# EAGLE design Estimulema v2 (EAGLE 8.7.1)

## Sheet 1 of 5
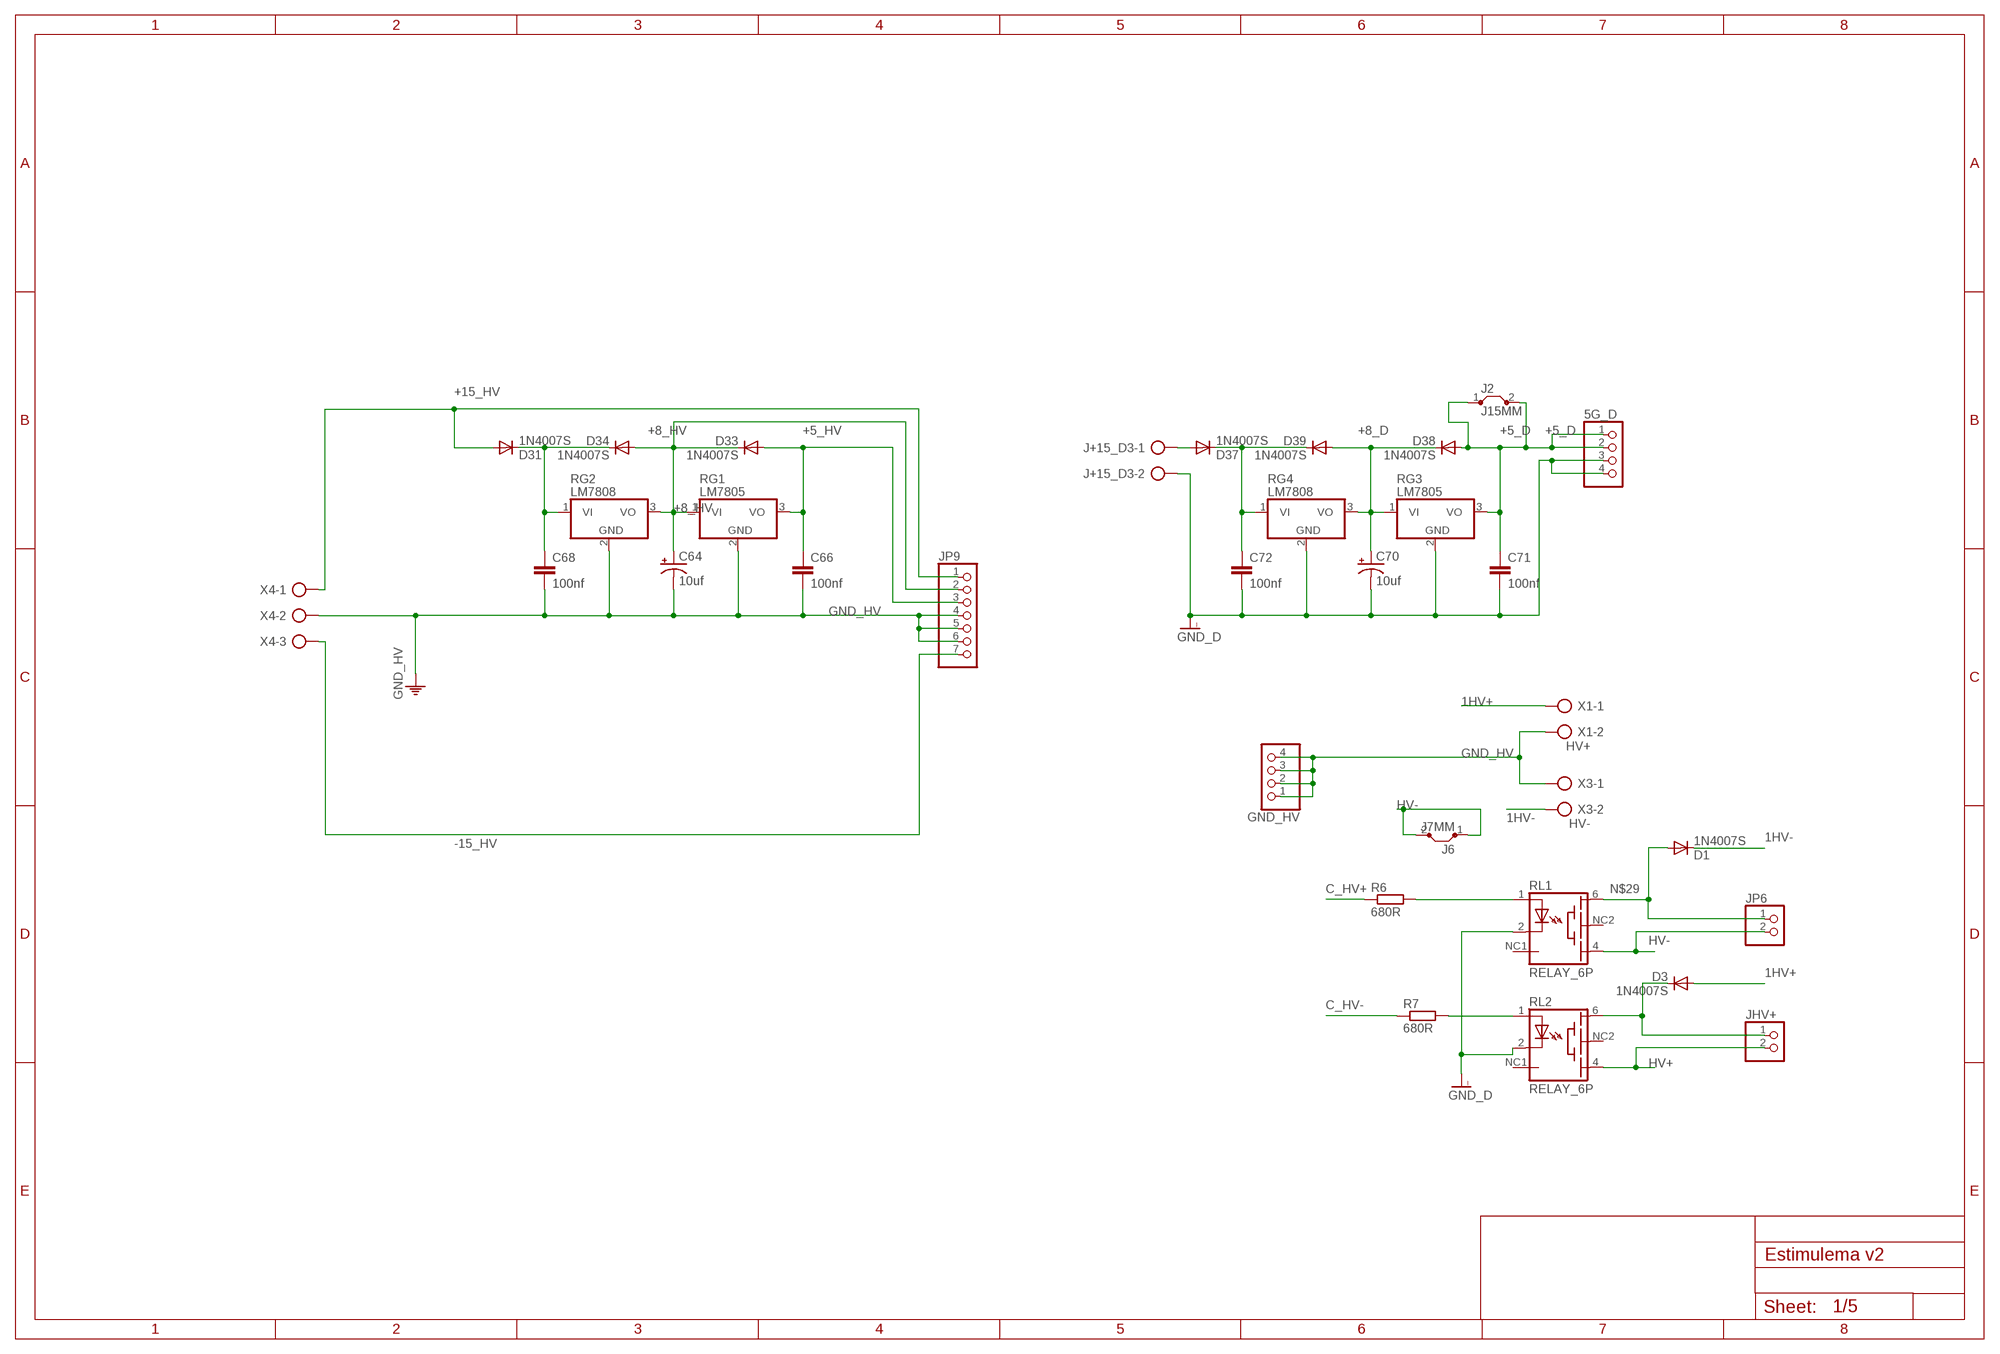
[diagram p0: schematic, sheet 1]

### Parts
5G_D  PINHD-1X4  [1X04]
C64  10uf  CPOL-USE2-5  [E2-5]
C66  100nf  C-EU025-024X044  [C025-024X044]
C68  100nf  C-EU025-024X044  [C025-024X044]
C70  10uf  CPOL-USE2-5  [E2-5]
C71  100nf  C-EU025-024X044  [C025-024X044]
C72  100nf  C-EU025-024X044  [C025-024X044]
D1  1N4007S  DIODO  [DIODO4MM]
D3  1N4007S  DIODO  [DIODO4MM]
D31  1N4007S  DIODO  [DIODO4MM]
D33  1N4007S  DIODO  [DIODO4MM]
D34  1N4007S  DIODO  [DIODO4MM]
D37  1N4007S  DIODO  [DIODO4MM]
D38  1N4007S  DIODO  [DIODO4MM]
D39  1N4007S  DIODO  [DIODO4MM]
GND_HV  PINHD-1X4  [1X04]
J2  J15MM  JUMPERS15MM  [15]
J6  J7MM  JUMPERS7MM  [07]
J+15_D3  AK300/2  [AK300/2]
JHV+  PINHD-1X2  [1X02]
JP6  PINHD-1X2  [1X02]
JP9  PINHD-1X7  [1X07]
R6  680R  RESISTORSMD_0805  [RESISTENCIA_0805]
R7  680R  RESISTORSMD_0805  [RESISTENCIA_0805]
RG1  LM7805  7805TV  [TO220V]
RG2  LM7808  7818TV  [TO220V]
RG3  LM7805  7805TV  [TO220V]
RG4  LM7808  7818TV  [TO220V]
RL1  RELAY_6P  [TS210]
RL2  RELAY_6P  [TS210]
X1  HV+  AK300/2  [AK300/2]
X3  HV-  AK300/2  [AK300/2]
X4  AK300/3  [AK300/3]

### Nets
1HV+ [GND_D]: D3.A X1.1
1HV- [GND_D]: D1.C X3.2
+5_D [+5_D]: 5G_D.1 5G_D.2 C71.1 D38.A J2.1 J2.2 RG3.3(VO) ; also sheet 2,5
+5_HV [+5_D]: C66.1 D33.A JP9.3 RG1.3(VO) ; also sheet 2
+8_D [SIGNAL]: C70.+ D38.C D39.A RG3.1(VI) RG4.3(VO)
+8_HV [SIGNAL]: C64.+ D33.C D34.A JP9.2 RG1.1(VI) RG2.3(VO)
+15_HV [SIGNAL]: D31.A JP9.1 X4.1 ; also sheet 3,4
-15_HV [SIGNAL]: JP9.7 X4.3 ; also sheet 3,4
C_HV+ [SIGNAL]: R6.1 ; also sheet 2
C_HV- [SIGNAL]: R7.1 ; also sheet 2
GND_D [GND_D]: 5G_D.3 5G_D.4 C70.- C71.2 C72.2 J+15_D3.2 RG3.2(GND) RG4.2(GND) RL1.2(C) RL2.2(C) ; also sheet 2,5
GND_HV [GND_HV1]: C64.- C66.2 C68.2 GND_HV.1 GND_HV.2 GND_HV.3 GND_HV.4 JP9.4 JP9.5 JP9.6 RG1.2(GND) RG2.2(GND) X1.2 X3.1 X4.2 ; also sheet 2,3,4,5
HV+ [GND_D]: JHV+.2 RL2.4(EMI) ; also sheet 3,4
HV- [GND_D]: J6.1 J6.2 JP6.2 RL1.4(EMI) ; also sheet 3,4
N$9: D37.A J+15_D3.1
N$24 [SIGNAL]: R6.2 RL1.1(A)
N$27 [SIGNAL]: R7.2 RL2.1(A)
N$29 [GND_D]: D1.A JP6.1 RL1.6(BAS)
N$30: D3.C JHV+.1 RL2.6(BAS)
N$157 [SIGNAL]: C68.1 D31.C D34.C RG2.1(VI)
N$158 [SIGNAL]: C72.1 D37.C D39.C RG4.1(VI)
Unconnected: RL1.NC1 RL1.NC2 RL2.NC1 RL2.NC2

## Sheet 2 of 5
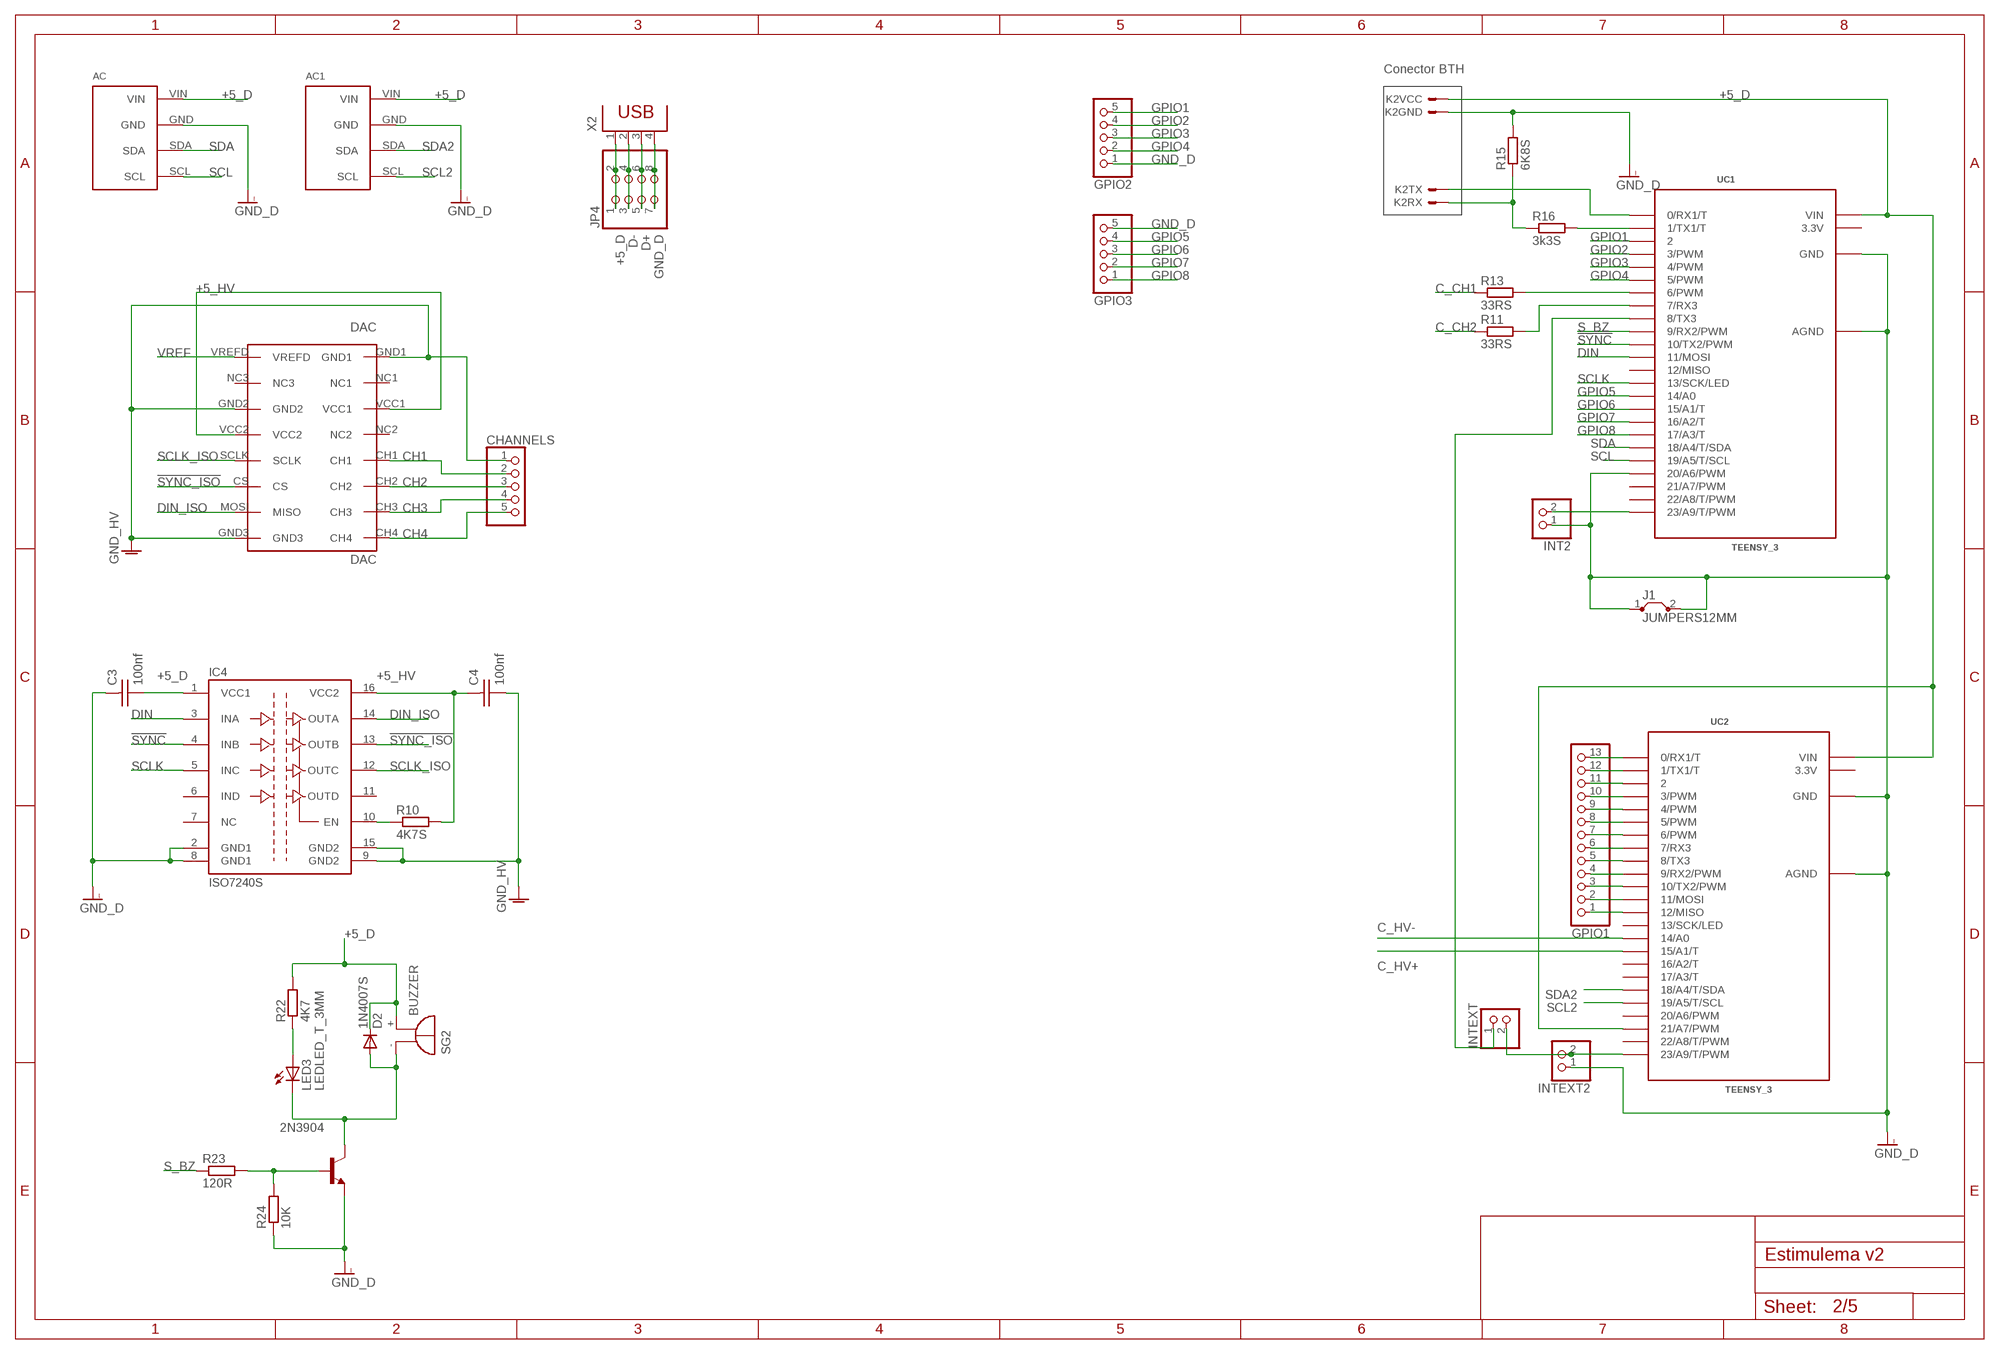
[diagram p1: schematic, sheet 2]

### Parts
2N3904  29-NPN-TO92-EBC  [TO92-EBC]
AC  CONECTOR_ACELEROMETRO_MPU6050CONECTOR_MPU6050  [MPU6050]
AC1  MPU6050  CONECTOR_ACELEROMETRO_MPU6050CONECTOR_MPU6050  [MPU6050]
C3  100nf  CAP_CERAMICO_SMD  [CAP_CER_SMD-0805]
C4  100nf  CAP_CERAMICO_SMD  [CAP_CER_SMD-0805]
CHANNELS  PINHD-1X5  [1X05]
D2  1N4007S  DIODO  [DIODO4MM]
DAC  DAC  DAC_MODULE  [DACMOD_P]
GPIO1  PINHD-1X13  [1X13]
GPIO2  PINHD-1X5  [1X05]
GPIO3  PINHD-1X5  [1X05]
IC4  ISO7240S  ISO7240_SMDDW  [SO-16DW]
INT2  PINHD-1X2  [1X02]
INTEXT  PINHD-1X2  [1X02]
INTEXT2  PINHD-1X2  [1X02]
J1  JUMPERS12MM  [12]
JP4  PINHD-2X4  [2X04]
K2  HC-06  CONECTOR_BTHC-06HC-06  [CONECTOR_BTHC-06]
LED3  LEDLED_T_3MM  [LED3MM]
R10  4K7S  RESISTORSMD_0805  [RESISTENCIA_0805]
R11  33RS  RESISTORSMD_0805  [RESISTENCIA_0805]
R13  33RS  RESISTORSMD_0805  [RESISTENCIA_0805]
R15  6K8S  RESISTORSMD_0805  [RESISTENCIA_0805]
R16  3k3S  RESISTORSMD_0805  [RESISTENCIA_0805]
R22  4K7  RESISTORSMD_0805  [RESISTENCIA_0805]
R23  120R  RESISTORSMD_0805  [RESISTENCIA_0805]
R24  10K  RESISTORSMD_0805  [RESISTENCIA_0805]
SG2  BUZZER  [BUZZER]
UC1  TEENSY_3  TEENSY_3.0_A_3.2VERSION_MINIMA  [TEENSY_3.0-3.2_DIL]
UC2  TEENSY_3  TEENSY_3.0_A_3.2VERSION_MINIMA  [TEENSY_3.0-3.2_DIL]
X2  PN61729  [PN61729]

### Nets
!SYNC [SIGNAL]: IC4.4(INB) UC1.10(10/TX2/PWM)
!SYNC_ISO [SIGNAL]: DAC.CS IC4.13(OUTB)
+5_D [+5_D]: AC1.VIN AC.VIN C3.2 D2.C IC4.1(VCC1) JP4.1 JP4.2 K2.1 R22.2 SG2.+(-) UC1.VIN UC2.21/A7(21/A7/PWM) UC2.VIN X2.1 ; also sheet 1,5
+5_HV [+5_D]: C4.1 DAC.VCC1 DAC.VCC2 IC4.16(VCC2) R10.2 ; also sheet 1
C_15D [SIGNAL]: GPIO1.11 UC2.2
C_CH1 [SIGNAL]: R13.1 ; also sheet 5
C_CH2 [SIGNAL]: R11.1 ; also sheet 5
C_HV+ [SIGNAL]: UC2.15/A1(15/A1/T) ; also sheet 1
C_HV- [SIGNAL]: UC2.14/A0 ; also sheet 1
CH1 [SIGNAL]: CHANNELS.2 DAC.CH1 ; also sheet 3
CH2 [SIGNAL]: CHANNELS.3 DAC.CH2 ; also sheet 4
CH3 [SIGNAL]: CHANNELS.4 DAC.CH3
CH4 [SIGNAL]: CHANNELS.5 DAC.CH4
D+ [SIGNAL]: JP4.5 JP4.6 X2.3
D- [SIGNAL]: JP4.3 JP4.4 X2.2
DIN [SIGNAL]: IC4.3(INA) UC1.11(11/MOSI)
DIN_ISO [SIGNAL]: DAC.MOSI(MISO) IC4.14(OUTA)
GND_D [GND_D]: 2N3904.E AC1.GND AC.GND GPIO2.1 GPIO3.5 INT2.1 INTEXT2.1 J1.1 J1.2 JP4.7 JP4.8 K2.2 R15.2 R24.1 UC1.20/A6(20/A6/PWM) UC1.AGND UC1.GND UC2.AGND UC2.GND X2.4 ; also sheet 1,5
GND_HV [GND_HV1]: C4.2 CHANNELS.1 DAC.GND1 DAC.GND2 DAC.GND3 IC4.9(GND2) IC4.15(GND2) ; also sheet 1,3,4,5
GNDI [GND_D]: C3.1 IC4.2(GND1) IC4.8(GND1) ; supply symbol labelled GND_D
GPIO1 [SIGNAL]: GPIO2.5 UC1.2
GPIO2 [SIGNAL]: GPIO2.4 UC1.3(3/PWM)
GPIO3 [SIGNAL]: GPIO2.3 UC1.4(4/PWM)
GPIO4 [SIGNAL]: GPIO2.2 UC1.5(5/PWM)
GPIO5 [SIGNAL]: GPIO3.4 UC1.14/A0
GPIO6 [SIGNAL]: GPIO3.3 UC1.15/A1(15/A1/T)
GPIO7 [SIGNAL]: GPIO3.2 UC1.16/A2(16/A2/T)
GPIO8 [SIGNAL]: GPIO3.1 UC1.17/A3(17/A3/T)
N$1: INTEXT2.2 INTEXT.2 UC2.23/A9(23/A9/T/PWM)
N$5: INTEXT.1 UC1.8(8/TX3)
N$6: GPIO1.13 UC2.0(0/RX1/T)
N$7: GPIO1.12 UC2.1(1/TX1/T)
N$10: GPIO1.10 UC2.3(3/PWM)
N$11: GPIO1.9 UC2.4(4/PWM)
N$12: GPIO1.8 UC2.5(5/PWM)
N$14: GPIO1.7 UC2.6(6/PWM)
N$15: GPIO1.6 UC2.7(7/RX3)
N$19: GPIO1.5 UC2.8(8/TX3)
N$20: GPIO1.4 UC2.9(9/RX2/PWM)
N$21: GPIO1.3 UC2.10(10/TX2/PWM)
N$22: GPIO1.2 UC2.11(11/MOSI)
N$23: GPIO1.1 UC2.12(12/MISO)
N$66 [SIGNAL]: IC4.10(EN) R10.1
N$67 [SIGNAL]: R13.2 UC1.6(6/PWM)
N$68 [SIGNAL]: R11.2 UC1.7(7/RX3)
N$69 [SIGNAL]: K2.4 R15.1 R16.1
N$70 [SIGNAL]: R16.2 UC1.1(1/TX1/T)
N$71 [SIGNAL]: K2.3 UC1.0(0/RX1/T)
N$72 [SIGNAL]: LED3.A R22.1
N$73 [SIGNAL]: 2N3904.C D2.A LED3.K(C) SG2.-(+)
N$74 [SIGNAL]: 2N3904.B R23.2 R24.2
N$75 [SIGNAL]: INT2.2 UC1.23/A9(23/A9/T/PWM)
S_BZ [SIGNAL]: R23.1 UC1.9(9/RX2/PWM)
SCL [SIGNAL]: AC.SCL UC1.19/A5(19/A5/T/SCL)
SCL2: AC1.SCL UC2.19/A5(19/A5/T/SCL)
SCLK [SIGNAL]: IC4.5(INC) UC1.13(13/SCK/LED)
SCLK_ISO [SIGNAL]: DAC.SCLK IC4.12(OUTC)
SDA [SIGNAL]: AC.SDA UC1.18/A4(18/A4/T/SDA)
SDA2: AC1.SDA UC2.18/A4(18/A4/T/SDA)
VREF [SIGNAL]: DAC.VREFD ; also sheet 3,4
Unconnected: DAC.NC1 DAC.NC2 DAC.NC3 IC4.6(IND) IC4.7(NC) IC4.11(OUTD) UC1.12(12/MISO) UC1.21/A7(21/A7/PWM) UC1.22/A8(22/A8/T/PWM) UC2.13(13/SCK/LED) UC2.16/A2(16/A2/T) UC2.17/A3(17/A3/T) UC2.20/A6(20/A6/PWM) UC2.22/A8(22/A8/T/PWM)

### Notes on the sheet
- Conector BTH

## Sheet 3 of 5
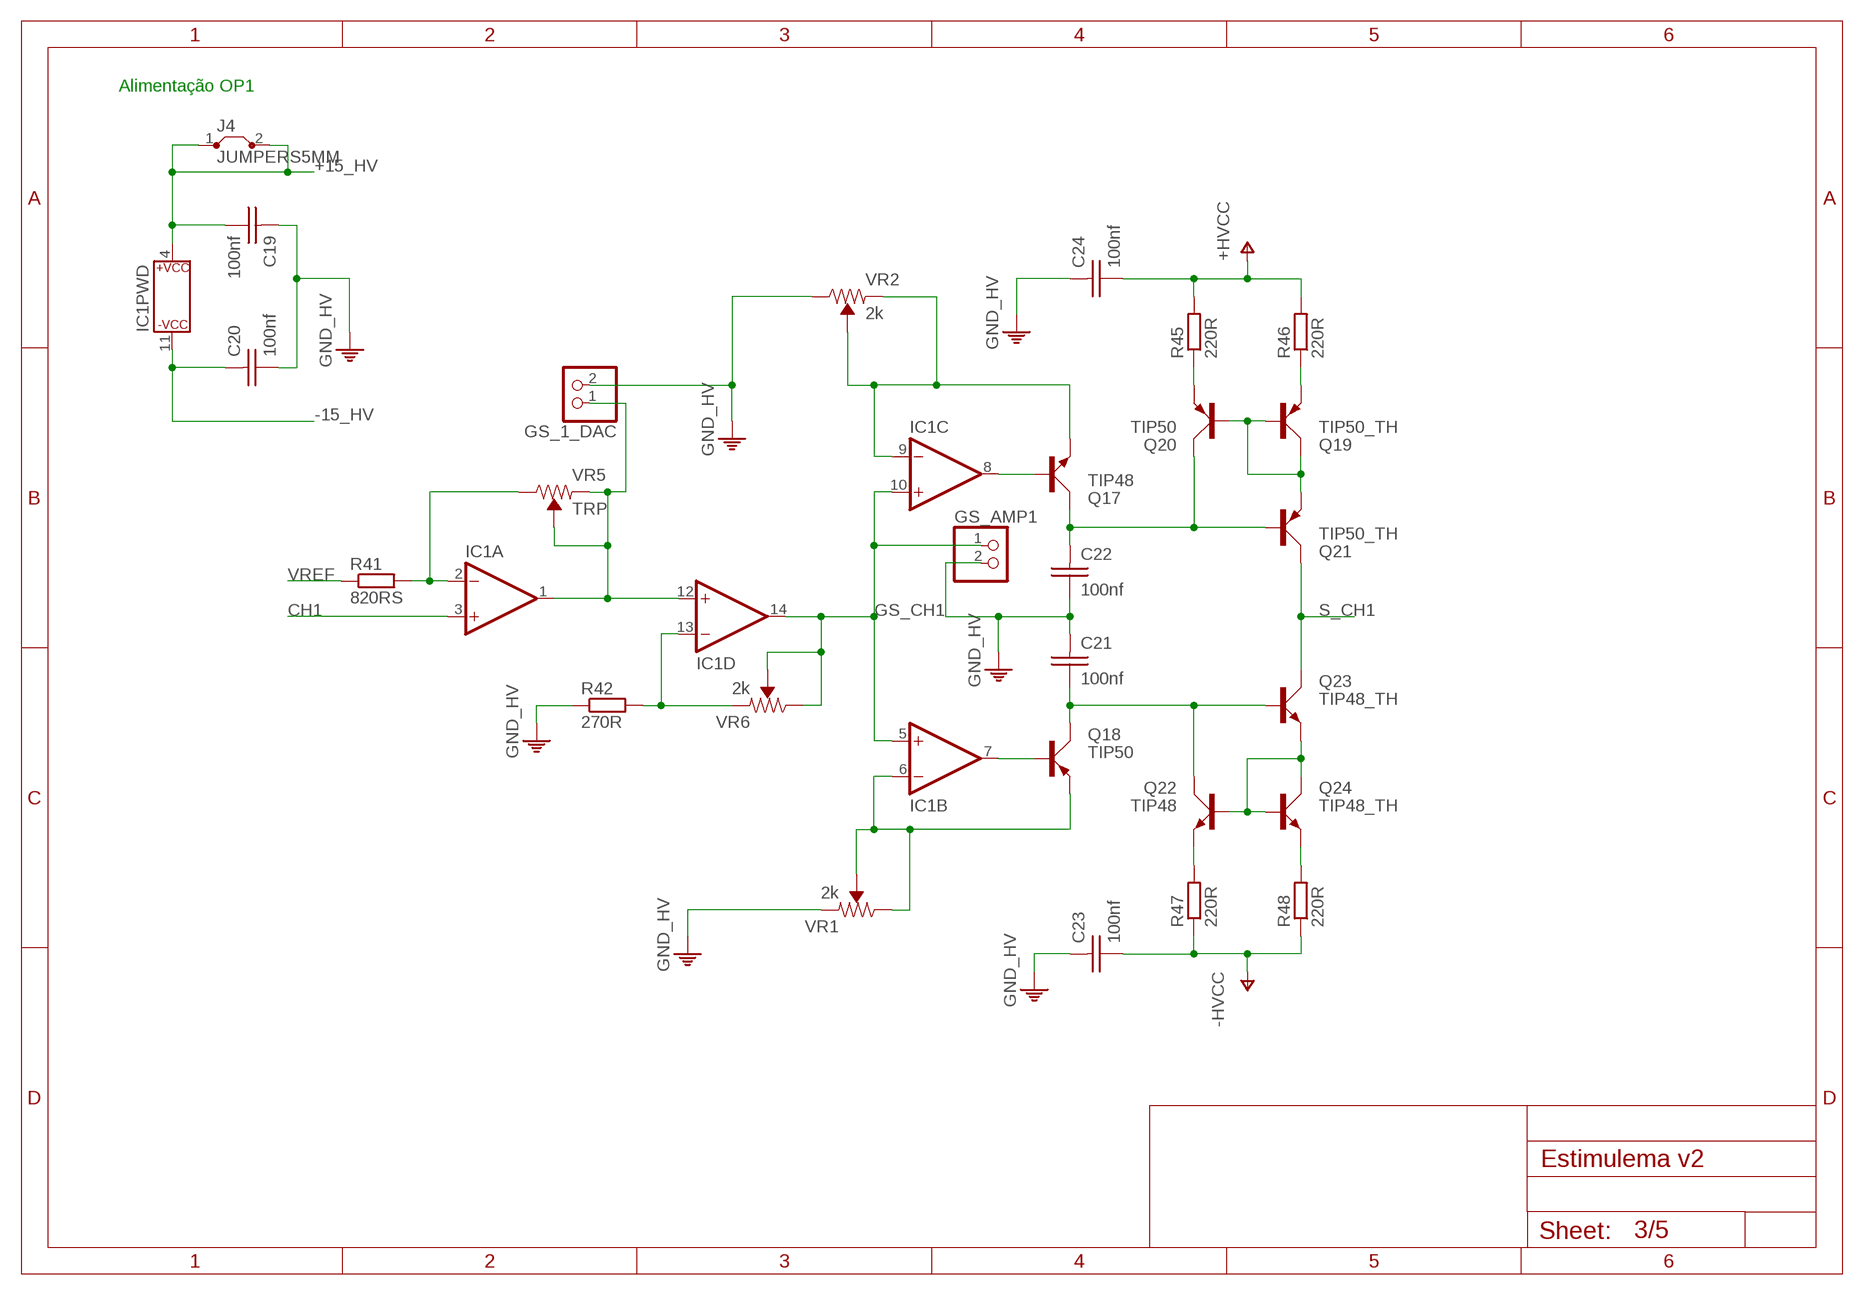
[diagram p2: schematic, sheet 3]

### Parts
C19  100nf  CAP_CERAMICO_SMD  [CAP_CER_SMD-0805]
C20  100nf  CAP_CERAMICO_SMD  [CAP_CER_SMD-0805]
C21  100nf  CAP_CERAMICO_TH2  [CAP_CER_2,54-5X5]
C22  100nf  CAP_CERAMICO_TH2  [CAP_CER_2,54-5X5]
C23  100nf  CAP_CERAMICO_TH16  [CAP_CER_16X7]
C24  100nf  CAP_CERAMICO_TH16  [CAP_CER_16X7]
GS_1_DAC  PINHD-1X2  [1X02]
GS_AMP1  PINHD-1X2  [1X02]
IC1  TL084  [DIL14]
J4  JUMPERS5MM  [05]
Q17  TIP48  TIP48_TH  [TO220]
Q18  TIP50  TIP50_TH  [TO220]
Q19  TIP50_TH  [TO220]
Q20  TIP50  TIP50_TH  [TO220]
Q21  TIP50_TH  [TO220]
Q22  TIP48  TIP48_TH  [TO220]
Q23  TIP48_TH  [TO220]
Q24  TIP48_TH  [TO220]
R41  820RS  RESISTORSMD_0805  [RESISTENCIA_0805]
R42  270R  RESISTORSMD_0805  [RESISTENCIA_0805]
R45  220R  RESISTORT_CORTO  [0204V]
R46  220R  RESISTORT_CORTO  [0204V]
R47  220R  RESISTORT_CORTO  [0204V]
R48  220R  RESISTORT_CORTO  [0204V]
VR1  2k  TRIMPOT_TH  [TRIMPOT-PTH-3386U]
VR2  2k  TRIMPOT_TH  [TRIMPOT-PTH-3386U]
VR5  TRP  TRIMPOT_TH  [TRIMPOT-PTH-3386U]
VR6  2k  TRIMPOT_TH  [TRIMPOT-PTH-3386U]

### Nets
+15_HV [SIGNAL]: C19.2 IC1.4(PWD:P$V+) J4.1 J4.2 ; also sheet 1,4
-15_HV [SIGNAL]: C20.1 IC1.11(PWD:P$V-) ; also sheet 1,4
CH1 [SIGNAL]: IC1.3(A:+IN) ; also sheet 2
GND_HV [GND_HV1]: C19.1 C20.2 C21.1 C22.2 C23.1 C24.1 GS_1_DAC.2 GS_AMP1.2 R42.1 VR1.1(CCW) VR2.3(CW) ; also sheet 1,2,4,5
GS_CH1 [SIGNAL]: GS_AMP1.1 IC1.5(B:+IN) IC1.10(C:+IN) IC1.14(D:OUT) VR6.2(WIPER) VR6.3(CW)
HV+ [GND_D]: C24.2 R45.2 R46.2 ; supply symbol labelled +HVCC ; also sheet 1,4
HV- [GND_D]: C23.2 R47.1 R48.1 ; supply symbol labelled -HVCC ; also sheet 1,4
N$106 [SIGNAL]: IC1.2(A:-IN) R41.2 VR5.3(CW)
N$107 [SIGNAL]: GS_1_DAC.1 IC1.1(A:OUT) IC1.12(D:+IN) VR5.1(CCW) VR5.2(WIPER)
N$108 [SIGNAL]: IC1.13(D:-IN) R42.2 VR6.1(CCW)
N$109 [SIGNAL]: IC1.9(C:-IN) Q17.E VR2.1(CCW) VR2.2(WIPER)
N$110 [SIGNAL]: IC1.6(B:-IN) Q18.E VR1.2(WIPER) VR1.3(CW)
N$111 [SIGNAL]: C21.2 Q18.C Q22.C Q23.B
N$112 [SIGNAL]: C22.1 Q17.C Q20.C Q21.B
N$113 [SIGNAL]: Q20.E R45.1
N$114 [GND_HV1]: Q19.E R46.1
N$115 [GND_HV1]: Q19.B Q19.C Q20.B Q21.E
N$116 [GND_HV1]: Q22.B Q23.E Q24.B Q24.C
N$117 [SIGNAL]: Q22.E R47.2
N$118 [GND_HV1]: Q24.E R48.2
N$119 [SIGNAL]: IC1.8(C:OUT) Q17.B
N$120 [SIGNAL]: IC1.7(B:OUT) Q18.B
S_CH1 [GND_HV1]: Q21.C Q23.C ; also sheet 5
VREF [SIGNAL]: R41.1 ; also sheet 2,4

### Notes on the sheet
- Alimentação OP1

## Sheet 4 of 5
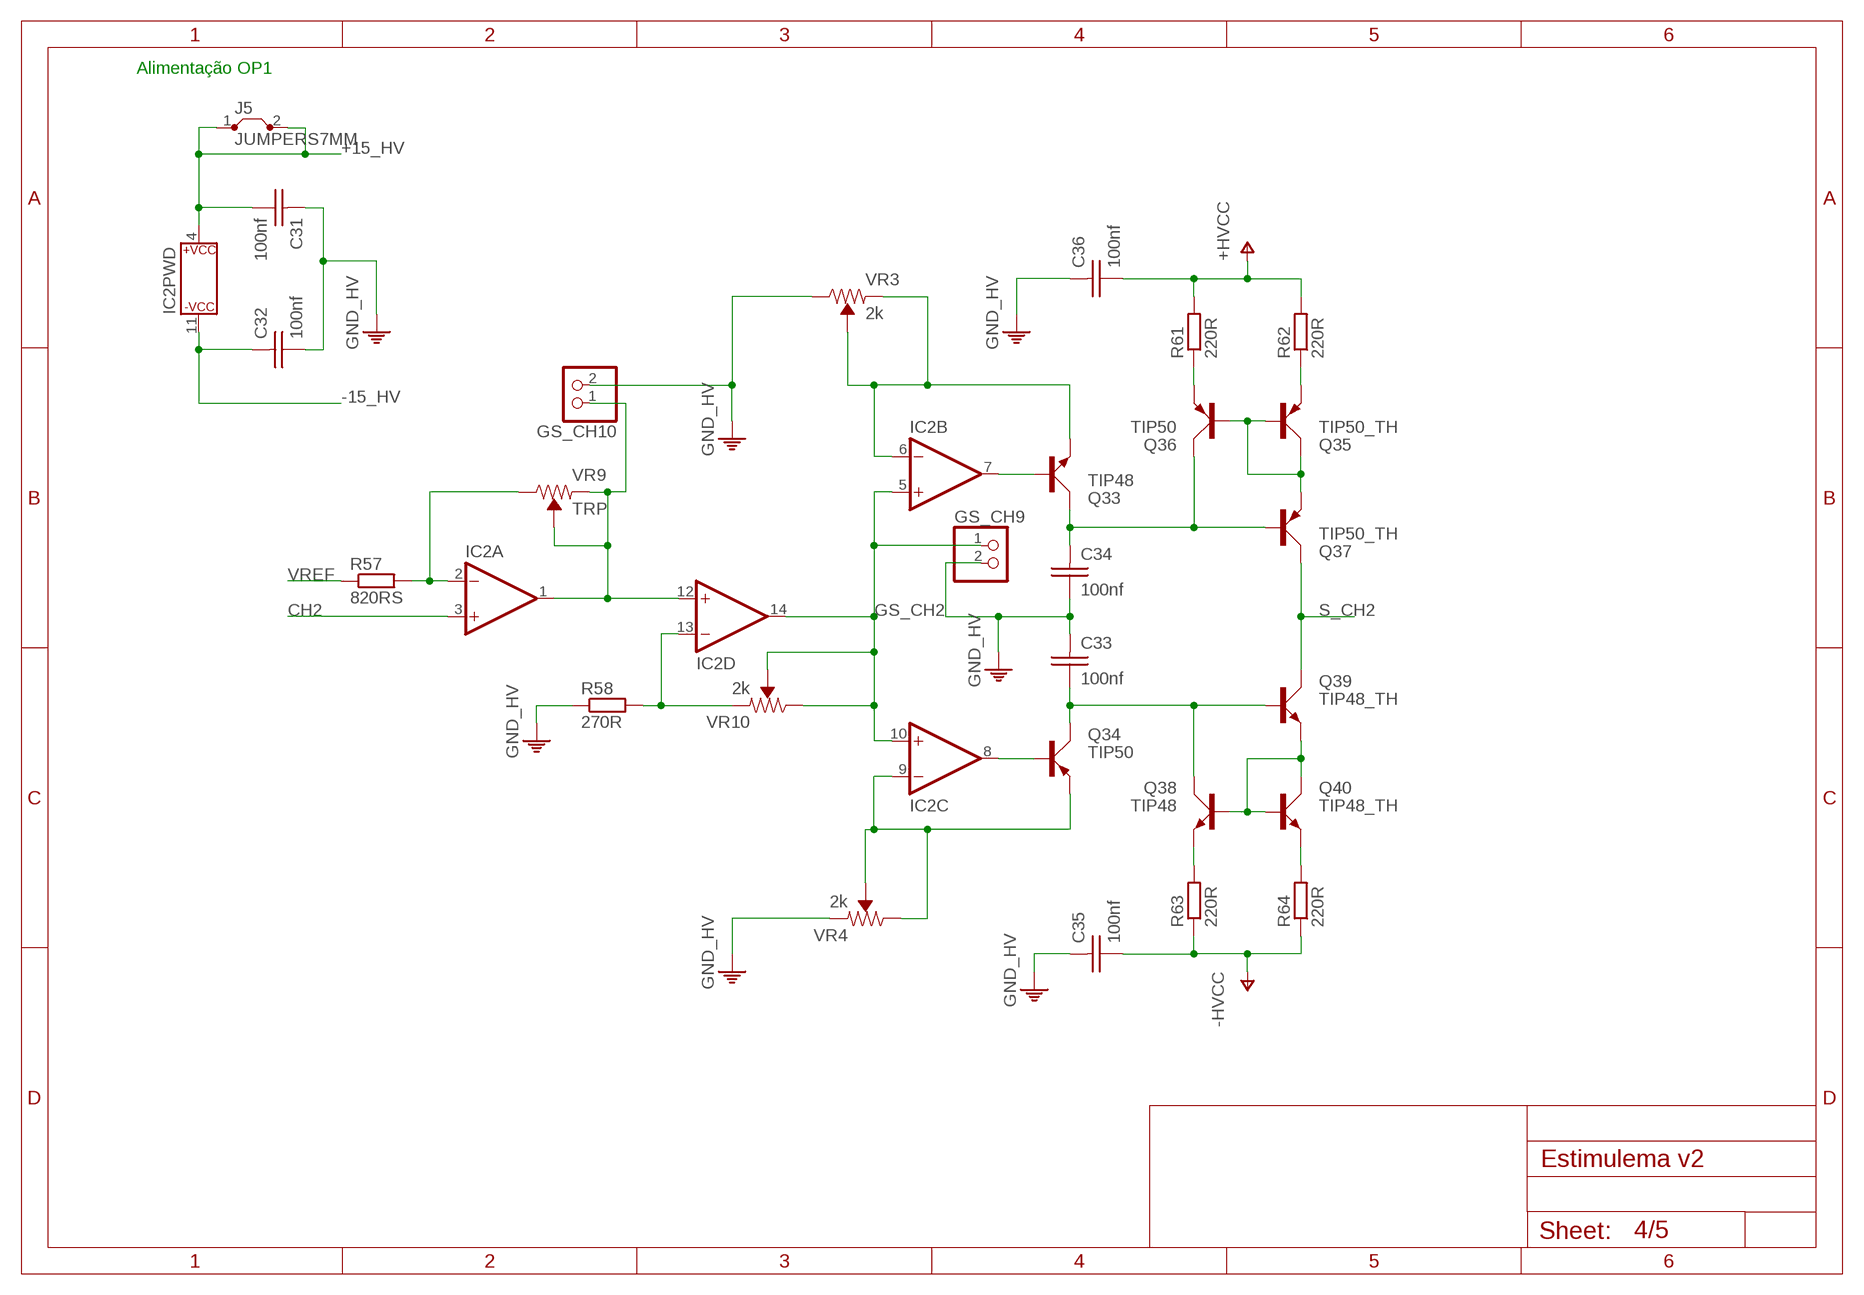
[diagram p3: schematic, sheet 4]

### Parts
C31  100nf  CAP_CERAMICO_SMD  [CAP_CER_SMD-0805]
C32  100nf  CAP_CERAMICO_SMD  [CAP_CER_SMD-0805]
C33  100nf  CAP_CERAMICO_TH2  [CAP_CER_2,54-5X5]
C34  100nf  CAP_CERAMICO_TH2  [CAP_CER_2,54-5X5]
C35  100nf  CAP_CERAMICO_TH16  [CAP_CER_16X7]
C36  100nf  CAP_CERAMICO_TH16  [CAP_CER_16X7]
GS_CH9  PINHD-1X2  [1X02]
GS_CH10  PINHD-1X2  [1X02]
IC2  TL084  [DIL14]
J5  JUMPERS7MM  [07]
Q33  TIP48  TIP48_TH  [TO220]
Q34  TIP50  TIP50_TH  [TO220]
Q35  TIP50_TH  [TO220]
Q36  TIP50  TIP50_TH  [TO220]
Q37  TIP50_TH  [TO220]
Q38  TIP48  TIP48_TH  [TO220]
Q39  TIP48_TH  [TO220]
Q40  TIP48_TH  [TO220]
R57  820RS  RESISTORSMD_0805  [RESISTENCIA_0805]
R58  270R  RESISTORSMD_0805  [RESISTENCIA_0805]
R61  220R  RESISTORT_CORTO  [0204V]
R62  220R  RESISTORT_CORTO  [0204V]
R63  220R  RESISTORT_CORTO  [0204V]
R64  220R  RESISTORT_CORTO  [0204V]
VR3  2k  TRIMPOT_TH  [TRIMPOT-PTH-3386U]
VR4  2k  TRIMPOT_TH  [TRIMPOT-PTH-3386U]
VR9  TRP  TRIMPOT_TH  [TRIMPOT-PTH-3386U]
VR10  2k  TRIMPOT_TH  [TRIMPOT-PTH-3386U]

### Nets
+15_HV [SIGNAL]: C31.2 IC2.4(PWD:P$V+) J5.1 J5.2 ; also sheet 1,3
-15_HV [SIGNAL]: C32.1 IC2.11(PWD:P$V-) ; also sheet 1,3
CH2 [SIGNAL]: IC2.3(A:+IN) ; also sheet 2
GND_HV [GND_HV1]: C31.1 C32.2 C33.1 C34.2 C35.1 C36.1 GS_CH9.2 GS_CH10.2 R58.1 VR3.3(CW) VR4.1(CCW) ; also sheet 1,2,3,5
GS_CH2 [SIGNAL]: GS_CH9.1 IC2.5(B:+IN) IC2.10(C:+IN) IC2.14(D:OUT) VR10.2(WIPER) VR10.3(CW)
HV+ [GND_D]: C36.2 R61.2 R62.2 ; supply symbol labelled +HVCC ; also sheet 1,3
HV- [GND_D]: C35.2 R63.1 R64.1 ; supply symbol labelled -HVCC ; also sheet 1,3
N$136 [SIGNAL]: IC2.2(A:-IN) R57.2 VR9.3(CW)
N$137 [SIGNAL]: GS_CH10.1 IC2.1(A:OUT) IC2.12(D:+IN) VR9.1(CCW) VR9.2(WIPER)
N$138 [SIGNAL]: IC2.13(D:-IN) R58.2 VR10.1(CCW)
N$139 [SIGNAL]: IC2.6(B:-IN) Q33.E VR3.1(CCW) VR3.2(WIPER)
N$140 [SIGNAL]: IC2.9(C:-IN) Q34.E VR4.2(WIPER) VR4.3(CW)
N$141 [SIGNAL]: C33.2 Q34.C Q38.C Q39.B
N$142 [SIGNAL]: C34.1 Q33.C Q36.C Q37.B
N$143 [SIGNAL]: Q36.E R61.1
N$144 [GND_HV1]: Q35.E R62.1
N$145 [GND_HV1]: Q35.B Q35.C Q36.B Q37.E
N$146 [GND_HV1]: Q38.B Q39.E Q40.B Q40.C
N$147 [SIGNAL]: Q38.E R63.2
N$148 [GND_HV1]: Q40.E R64.2
N$149 [SIGNAL]: IC2.7(B:OUT) Q33.B
N$150 [SIGNAL]: IC2.8(C:OUT) Q34.B
S_CH2 [SIGNAL]: Q37.C Q39.C ; also sheet 5
VREF [SIGNAL]: R57.1 ; also sheet 2,3

### Notes on the sheet
- Alimentação OP1

## Sheet 5 of 5
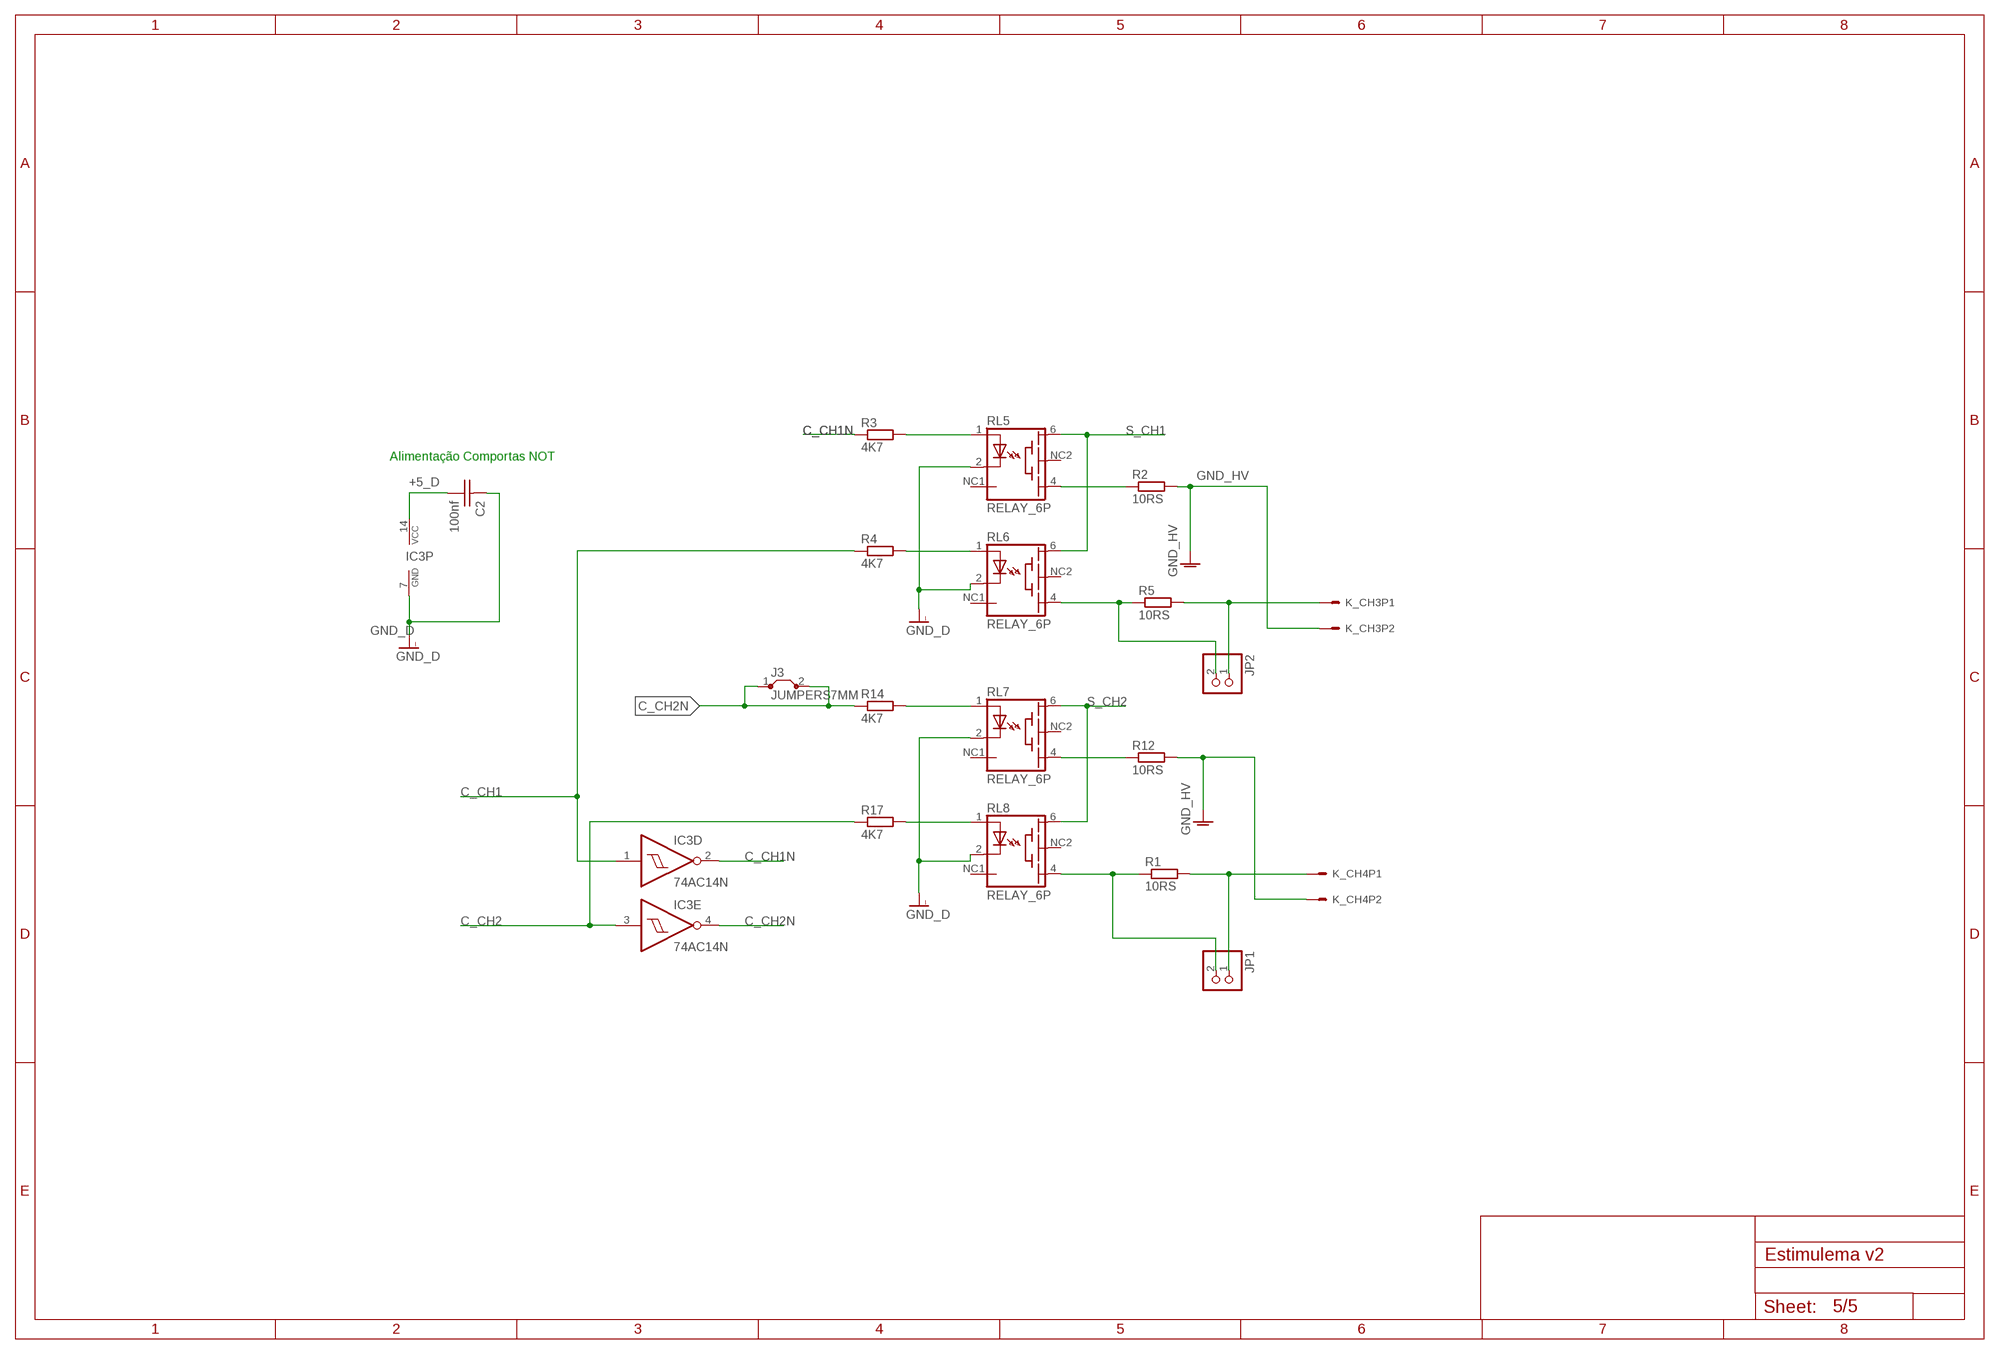
[diagram p4: schematic, sheet 5]

### Parts
C2  100nf  CAP_CERAMICO_SMD  [CAP_CER_SMD-0805]
IC3  74AC14N  [DIL14]
J3  JUMPERS7MM  [07]
JP1  PINHD-1X2  [1X02]
JP2  PINHD-1X2  [1X02]
K_CH3  CONECTOR_5.08  [CONECTOR_X2_5.08]
K_CH4  CONECTOR_5.08  [CONECTOR_X2_5.08]
R1  10RS  RESISTORT_LARGO  [0204/5]
R2  10RS  RESISTORT_GRANDE  [0617V]
R3  4K7  RESISTORSMD_0805  [RESISTENCIA_0805]
R4  4K7  RESISTORSMD_0805  [RESISTENCIA_0805]
R5  10RS  RESISTORT_LARGO  [0204/5]
R12  10RS  RESISTORT_GRANDE  [0617V]
R14  4K7  RESISTORSMD_0805  [RESISTENCIA_0805]
R17  4K7  RESISTORSMD_0805  [RESISTENCIA_0805]
RL5  RELAY_6P  [TS210]
RL6  RELAY_6P  [TS210]
RL7  RELAY_6P  [TS210]
RL8  RELAY_6P  [TS210]

### Nets
+5_D [+5_D]: C2.2 IC3.14(P:VCC) ; also sheet 1,2
C_CH1 [SIGNAL]: IC3.1(D:I) R4.1 ; also sheet 2
C_CH1N [SIGNAL]: IC3.2(D:O) R3.1
C_CH2 [SIGNAL]: IC3.3(E:I) R17.1 ; also sheet 2
C_CH2N [SIGNAL]: IC3.4(E:O) J3.1 J3.2 R14.1
GND_D [GND_D]: C2.1 IC3.7(P:GND) RL5.2(C) RL6.2(C) RL7.2(C) RL8.2(C) ; also sheet 1,2
GND_HV [GND_HV1]: K_CH3.2 K_CH4.2 R2.2 R12.2 ; also sheet 1,2,3,4
N$2 [SIGNAL]: R3.2 RL5.1(A)
N$3 [SIGNAL]: R4.2 RL6.1(A)
N$4 [GND_HV1]: R2.1 RL5.4(EMI)
N$8: JP2.2 R5.1 RL6.4(EMI)
N$13 [SIGNAL]: R14.2 RL7.1(A)
N$16 [SIGNAL]: R17.2 RL8.1(A)
N$17 [GND_HV1]: R12.1 RL7.4(EMI)
N$18: JP2.1 K_CH3.1 R5.2
N$25: JP1.1 K_CH4.1 R1.2
N$26: JP1.2 R1.1 RL8.4(EMI)
S_CH1 [GND_HV1]: RL5.6(BAS) RL6.6(BAS) ; also sheet 3
S_CH2 [SIGNAL]: RL7.6(BAS) RL8.6(BAS) ; also sheet 4
Unconnected: IC3.5(F:I) IC3.6(F:O) IC3.8(C:O) IC3.9(C:I) IC3.10(B:O) IC3.11(B:I) IC3.12(A:O) IC3.13(A:I) RL5.NC1 RL5.NC2 RL6.NC1 RL6.NC2 RL7.NC1 RL7.NC2 RL8.NC1 RL8.NC2

### Notes on the sheet
- Alimentação Comportas NOT

## Power pins joined to a net without a drawn wire
3.3V: UC1.3.3V UC2.3.3V

## Library data of the parts
2N3904 = transistor:*-NPN-: NPN Transistror BF959 corrected 2008.03.06
5G_D GND_HV = pinhead:PINHD-1X4: PIN HEADER
AC AC1 = 7DI Library:CONECTOR_ACELEROMETRO_MPU6050: Conector para el Acelerometro MPU6050 I2C
C2-C4 C19-C24 C31-C36 = 7DI Library:CAP_CERAMICO: Capacitores ceramicos y de poliester, entre otros
C64 C70 = resistor:CPOL-US: POLARIZED CAPACITOR, American symbol
C66 C68 C71 C72 = resistor:C-EU: CAPACITOR, European symbol
CHANNELS GPIO2 GPIO3 = pinhead:PINHD-1X5: PIN HEADER
D1-D3 D31 D33 D34 D37-D39 = 7DI Library:DIODO: Diodo usado para protecion en las fuentes de alimentacion
DAC = 7DI Library:DAC_MODULE: Modulo feito para o dac com seu regulador
GPIO1 = pinhead:PINHD-1X13: PIN HEADER
GS_1_DAC GS_AMP1 GS_CH9 GS_CH10 INT2 INTEXT INTEXT2 JHV+ JP1 JP2 JP6 = pinhead:PINHD-1X2: PIN HEADER
IC1 IC2 = 7DI Library:TL084: IC TL084 Quad Op Amp
IC3 = 74xx-eu:74*14: Hex schmitt trigger INVERTER
IC4 = 7DI Library:ISO7240_SMD: ISO7240 High Speed Quad Digital Isolators
J1-J6 = 7DI Library:JUMPERS: Bridge
J+15_D3 X1 X3 = con-ptr500:AK300/2: CONNECTOR; OC_FARNELL: unknown; OC_NEWARK: unknown
JP4 = pinhead:PINHD-2X4: PIN HEADER
JP9 = pinhead:PINHD-1X7: PIN HEADER
K2 = 7DI Library:CONECTOR_BTHC-06: CONECTOR DEL MODULO BLUETOOTH HC-06
K_CH3 K_CH4 = 7DI Library:CONECTOR_: Diferentes tipos de conectores
LED3 = 7DI Library:LED: Diodo led de 3, 5 mm y SMD 0805
Q17 Q22-Q24 Q33 Q38-Q40 = 7DI Library:TIP48: NPN TRANSISTOR
Q18-Q21 Q34-Q37 = 7DI Library:TIP50: PNP TRANSISTOR
R1-R7 R10-R17 R22-R24 R41 R42 R45-R48 R57 R58 R61-R64 = 7DI Library:RESISTOR: Resistor con varias variantes
RG1-RG4 = linear:78*: Positive VOLTAGE REGULATOR Source: http://cache.national.com/ds/LM/LM78L05.pdf http://www.fairchildsemi.com/ds/LM/LM7805.pdf
RL1 RL2 RL5-RL8 = 7DI Library:RELAY_: Rele de estado solido
SG2 = 7DI Library:BUZZER: BUZZER Source: Buerklin; OC_FARNELL: unknown; OC_NEWARK: unknown
UC1 UC2 = 7DI Library:TEENSY_3.0_A_3.2: Unidade de controle baseada em Teensy 3.x
VR1-VR4 VR6 VR10 = 7DI Library:TRIMPOT: Trimming Potentiometer (Trimpot); PROD_ID: ''; SF_SKU: ''; VALUE: TRP
VR5 VR9 = 7DI Library:TRIMPOT: Trimming Potentiometer (Trimpot); PROD_ID: ''; SF_SKU: ''
X2 = con-berg:PN61729: BERG USB connector; OC_FARNELL: unknown; OC_NEWARK: unknown
X4 = con-ptr500:AK300/3: CONNECTOR; OC_FARNELL: unknown; OC_NEWARK: unknown

## Net classes
1 GND_HV: width 0.813 mm
2 SIGNAL: width 0.508 mm
3 GND_D: width 0.61 mm
4 +5_D: width 0.61 mm
5 GND_HV1: width 0.813 mm

## Board
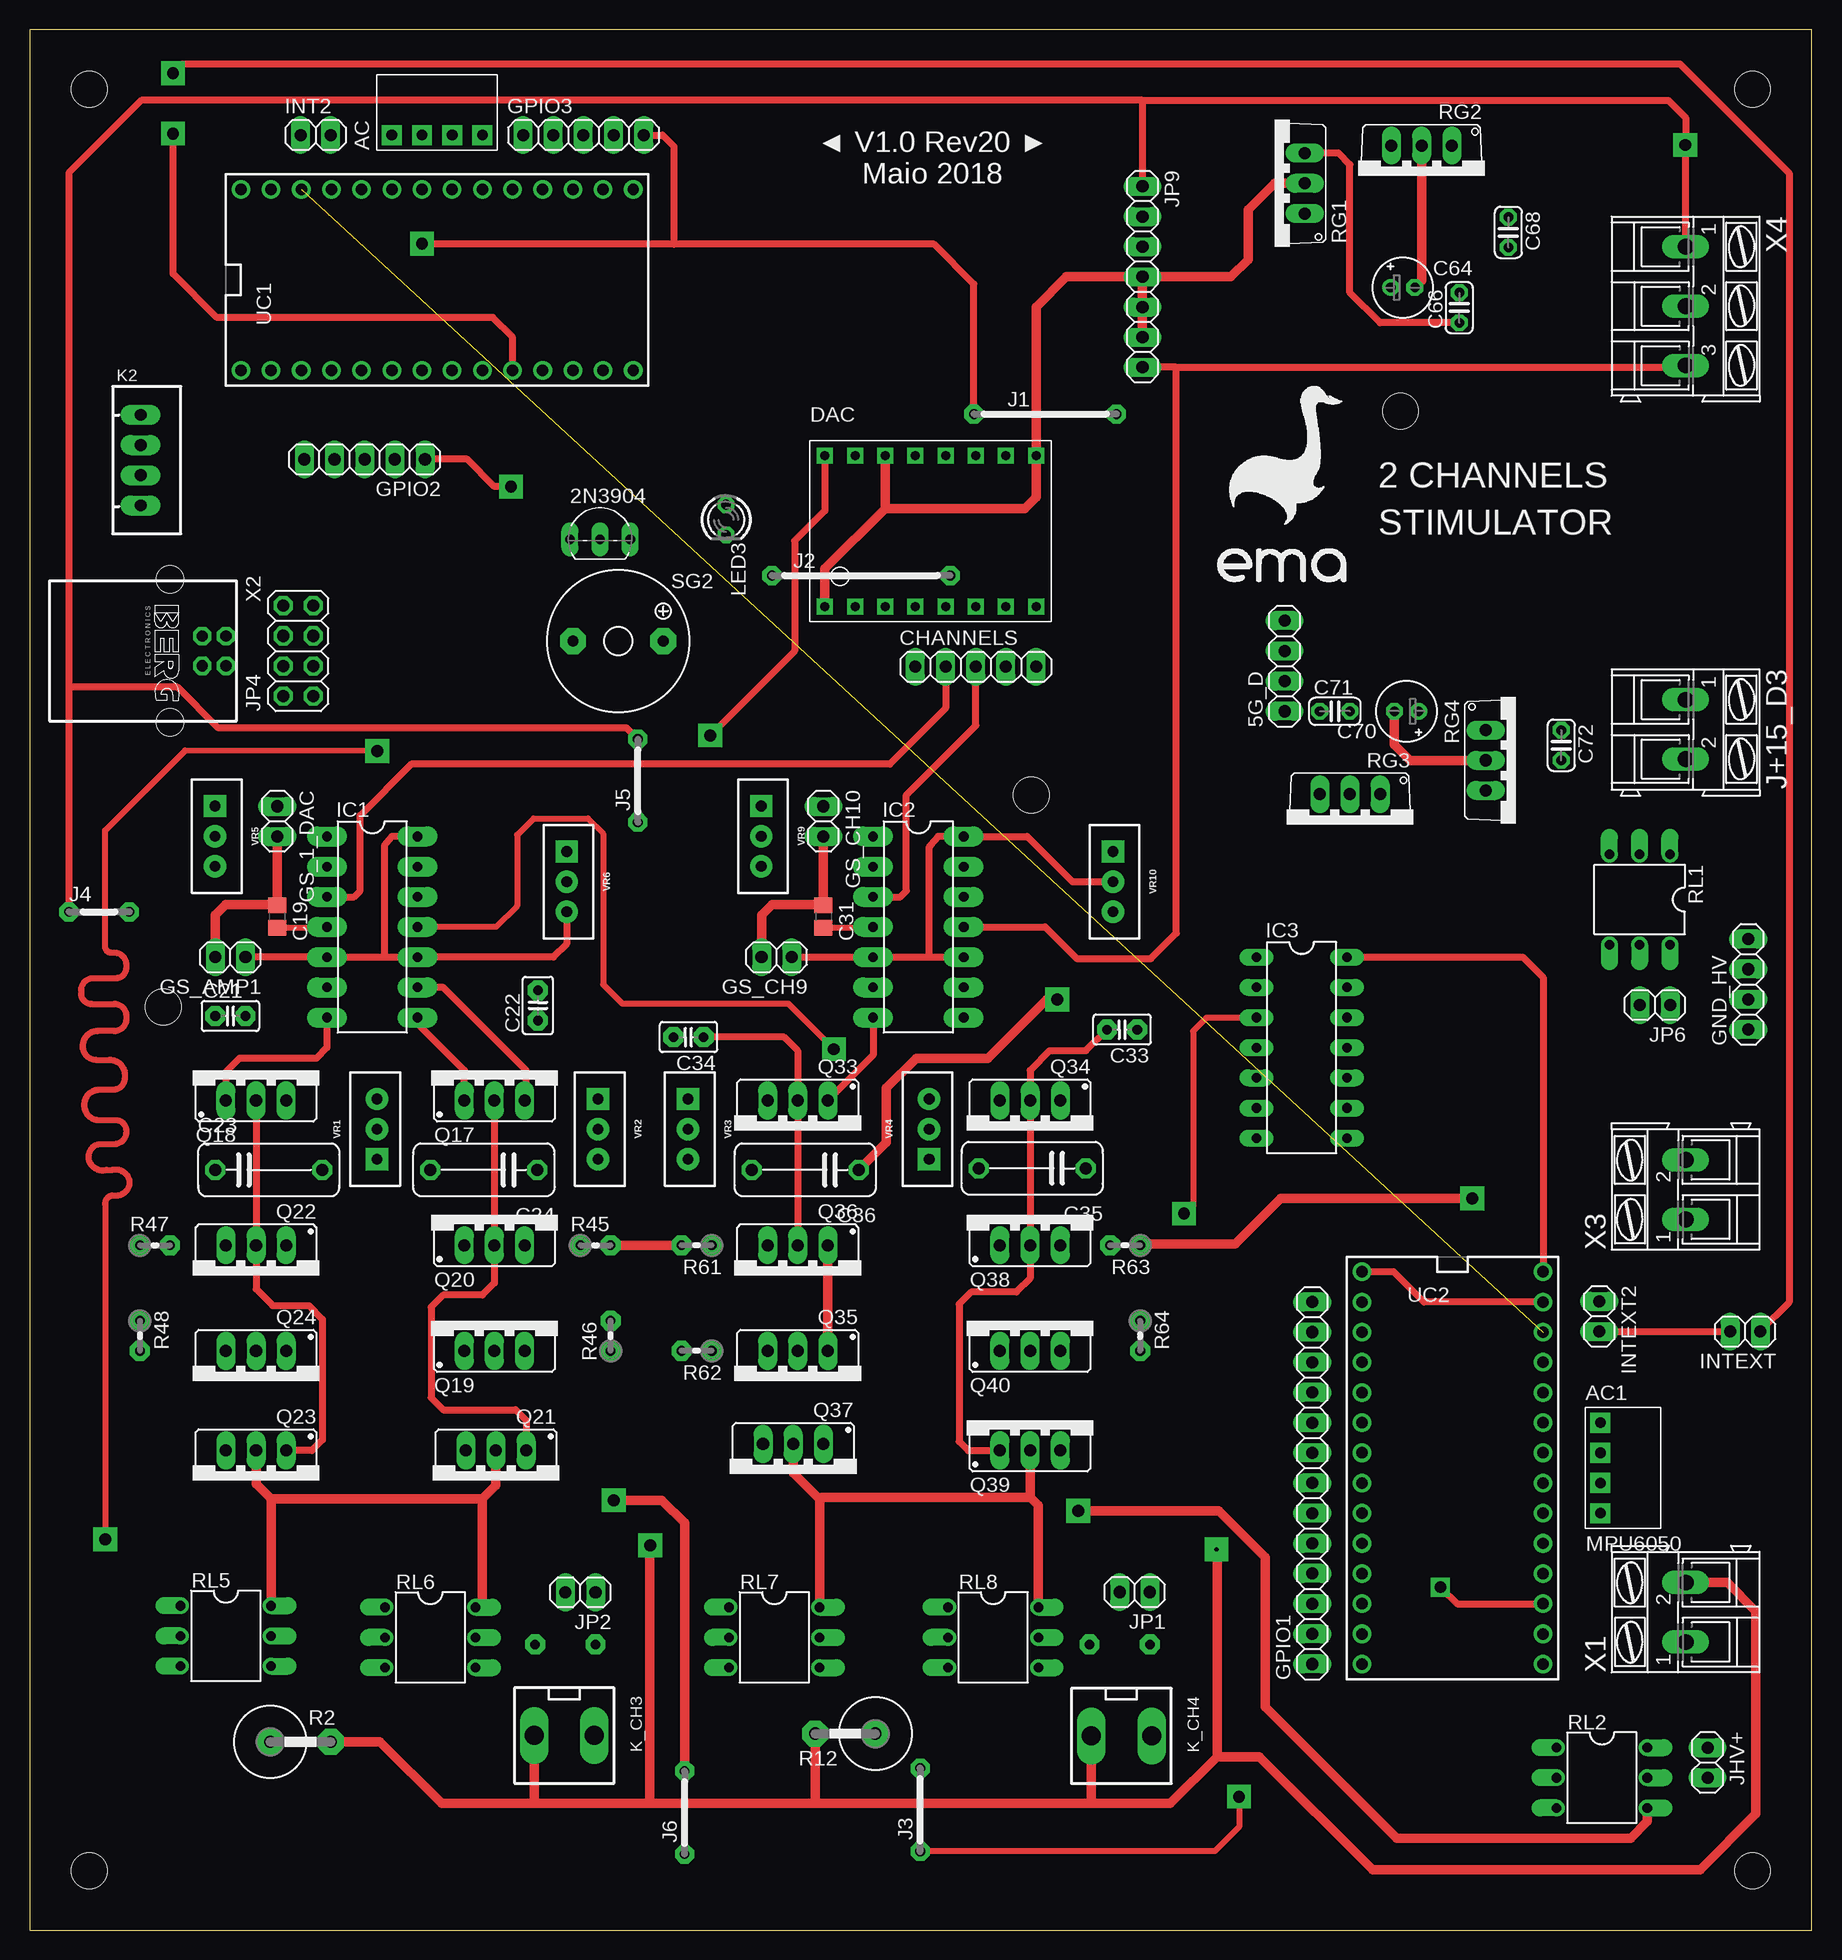
[diagram p5: board, top side]
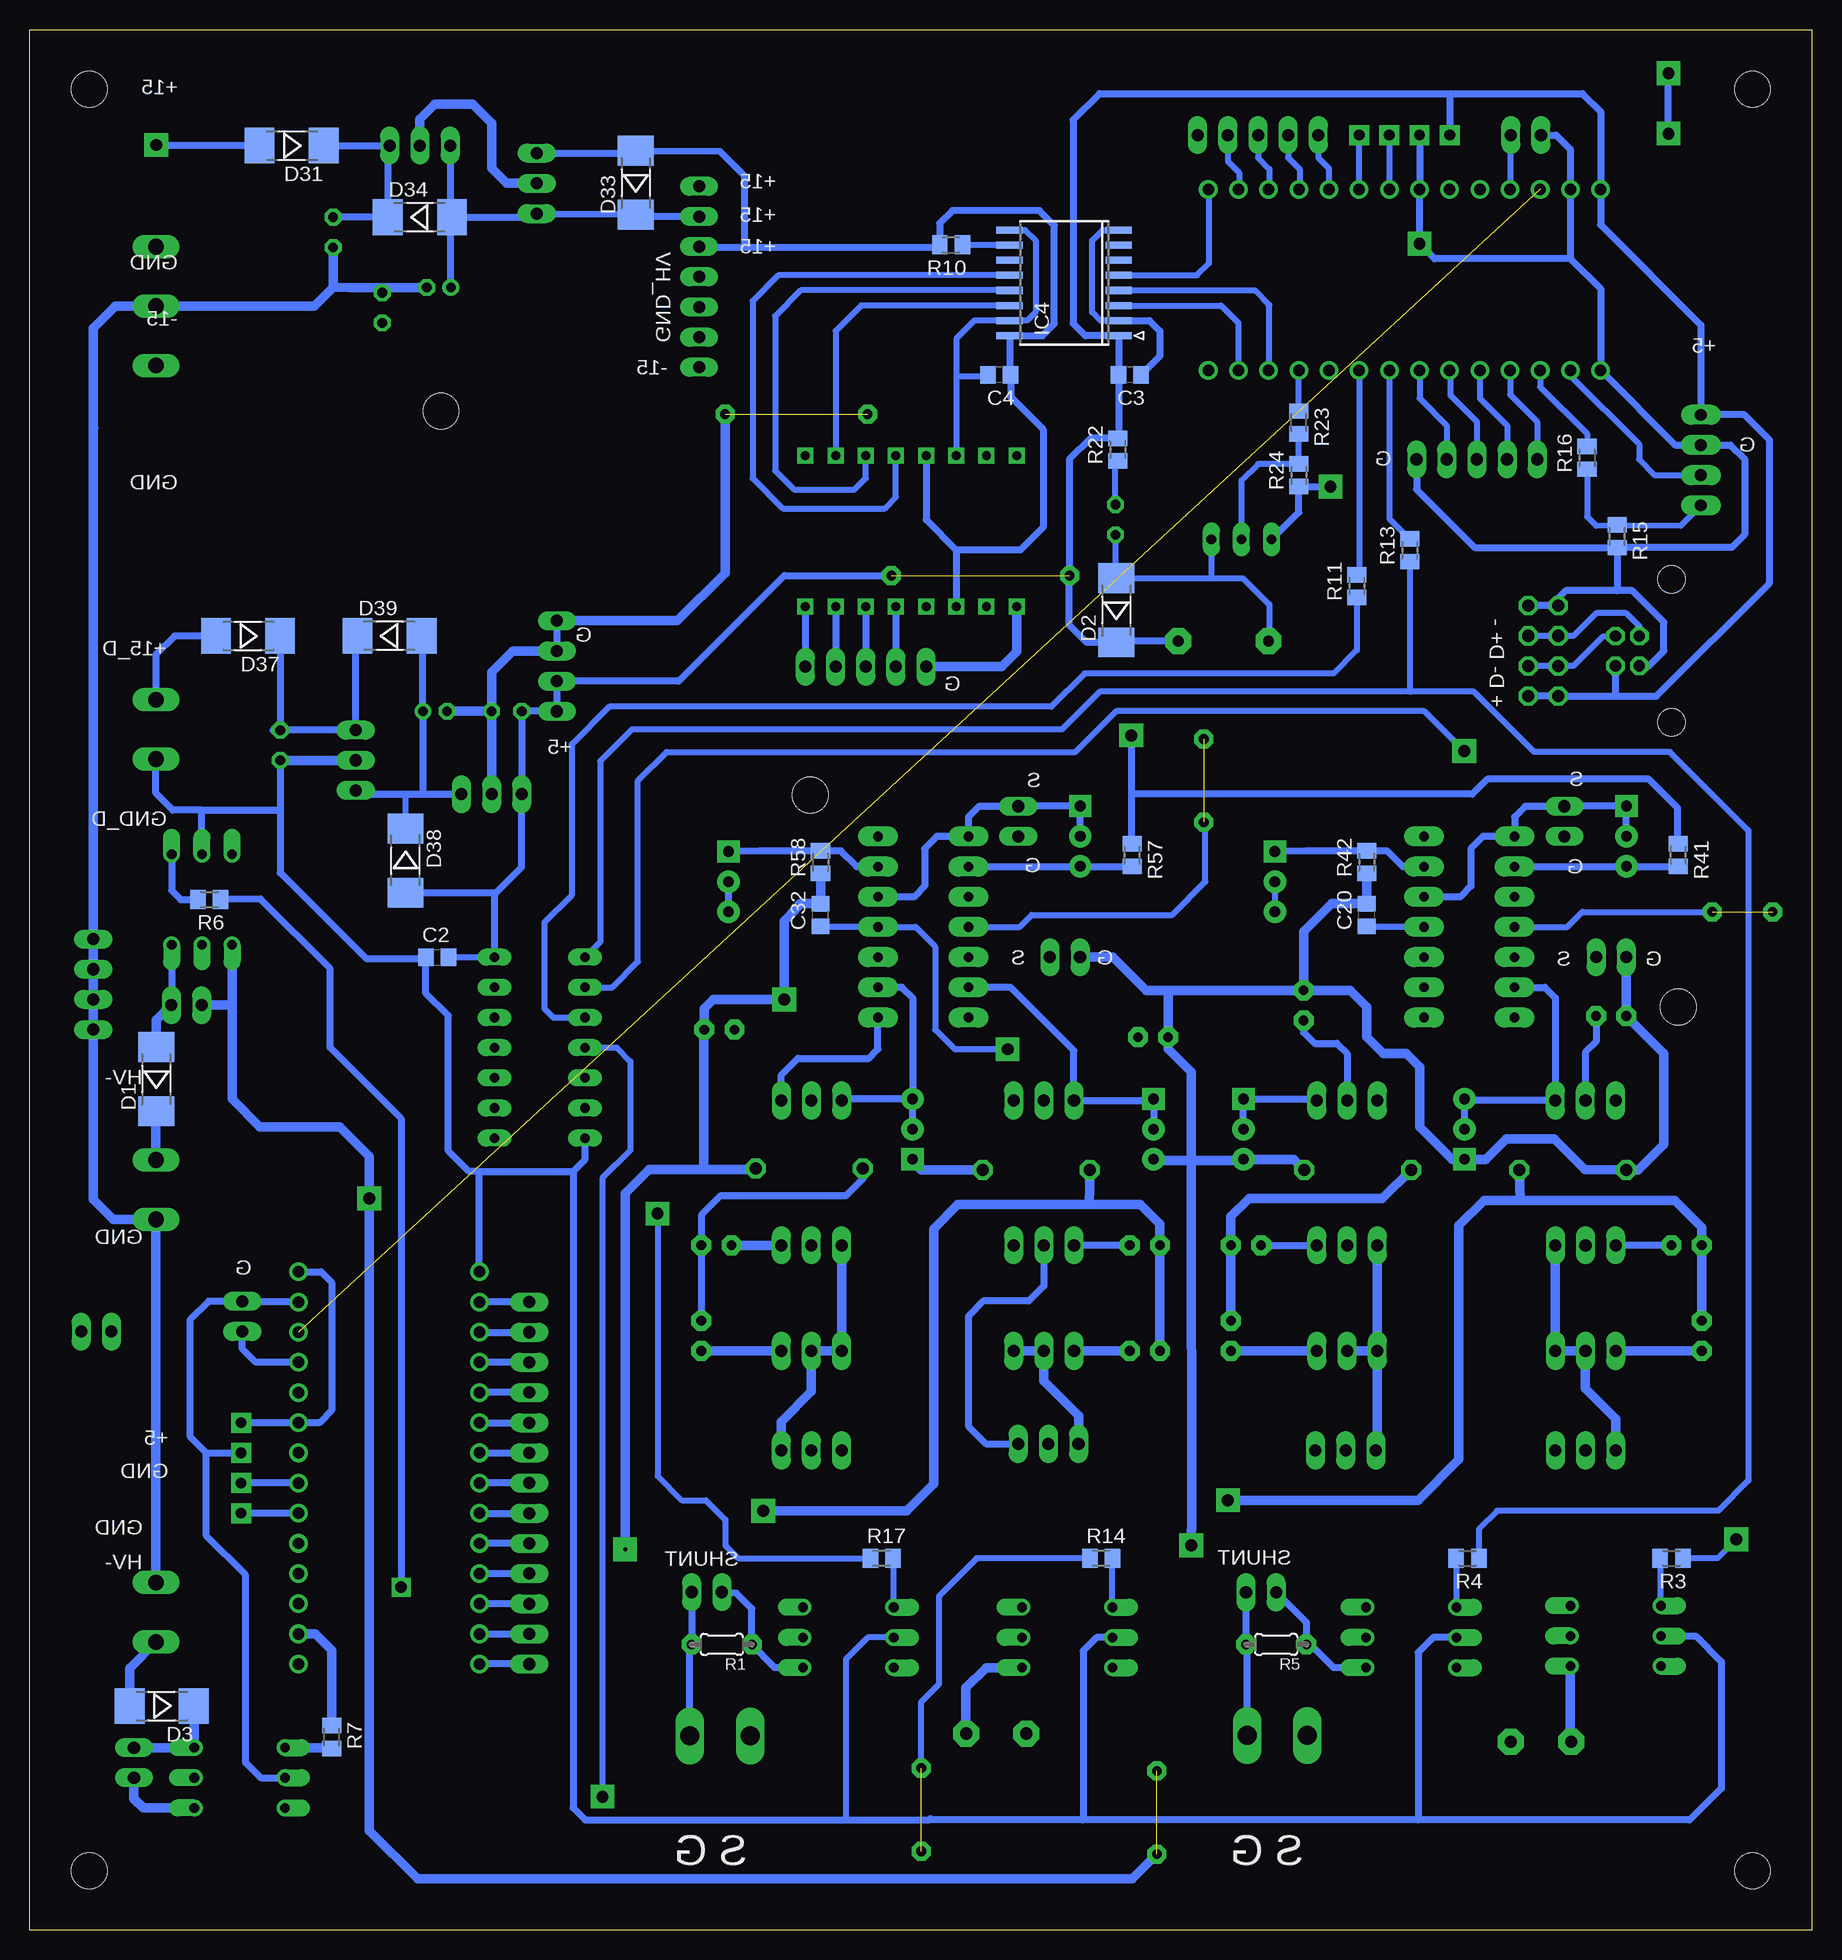
[diagram p6: board, bottom side, seen from below]

Size 150 x 160 mm. Coordinates in mm from the lower left corner, seen from the top.
Outline: 0,0 150,0 150,160 0,160 0,0
Copper layers (1*16): Top 0.035mm / dielectric 1.5mm / Bottom 0.035mm
Design rules "default *": minimum track width 6mil, minimum drill 0.35mm, track to track 6mil, track to pad 6mil, pad to pad 6mil, via to via 6mil, smd to smd 6mil, copper to edge 40mil, drill to drill 6mil, minimum pad ring 0.3mm, minimum via ring 0.3mm, stop-mask expansion 4mil, vias tented up to drill 0mil, thermal gap 10mil
Holes 3 mm at 5,5 145,5 145,155 5,155 84.29,95.56 115.38,127.9 11.24,77.73

### Footprints (pad centres in the part's own frame; a part is rotated, then mirrored left to right if it is on the bottom)
TO92-EBC = drill 0.813 long: B 0,-1.27; C 2.54,-1.27; E -2.54,-1.27
1X04 = drill 1.016 long: 1 -3.81,0; 2 -1.27,0; 3 1.27,0; 4 3.81,0
MPU6050 = drill 0.9 pad 1.676 square: GND -2.54,0; SCL -2.54,-2.54; SDA -2.54,-5.08; VIN -2.54,2.54
CAP_CER_SMD-0805 = smd 1.3 x 1.5: 1 -0.95,0; 2 0.95,0
CAP_CER_2,54-5X5 = drill 0.813 pad 1.676 octagon: 1 -1.27,0; 2 1.27,0
CAP_CER_16X7 = drill 1 pad 1.676 octagon: 1 -4.5,0; 2 4.5,0
E2-5 = drill 0.813 pad 1.27: + -1.016,0 | drill 0.813 pad 1.27 octagon: - 1.016,0
C025-024X044 = drill 0.813 octagon: 1 -1.27,0; 2 1.27,0
1X05 = drill 1.016 long: 1 -5.08,0; 2 -2.54,0; 3 0,0; 4 2.54,0; 5 5.08,0
DIODO4MM = smd 2.5 x 3: A 2.7,0; C -2.7,0
DACMOD_P = drill 0.75 square: CH1 1.27,-6.35; CH2 3.81,-6.35; CH3 6.35,-6.35; CH4 8.89,-6.35; CS 3.81,6.35; GND1 -8.89,-6.35; GND2 -3.81,6.35; GND3 8.89,6.35; MOSI 6.35,6.35; NC1 -6.35,-6.35; NC2 -1.27,-6.35; NC3 -6.35,6.35; SCLK 1.27,6.35; VCC1 -3.81,-6.35; VCC2 -1.27,6.35; VREFD -8.89,6.35
1X13 = drill 1.016 long: 1 -15.24,0; 2 -12.7,0; 3 -10.16,0; 4 -7.62,0; 5 -5.08,0; 6 -2.54,0; 7 0,0; 8 2.54,0; 9 5.08,0; 10 7.62,0; 11 10.16,0; 12 12.7,0; 13 15.24,0
1X02 = drill 1.016 long: 1 -1.27,0; 2 1.27,0
DIL14 = drill 0.813 pad 1.676 long: 1 -7.62,-3.81; 2 -5.08,-3.81; 3 -2.54,-3.81; 4 0,-3.81; 5 2.54,-3.81; 6 5.08,-3.81; 7 7.62,-3.81; 8 7.62,3.81; 9 5.08,3.81; 10 2.54,3.81; 11 0,3.81; 12 -2.54,3.81; 13 -5.08,3.81; 14 -7.62,3.81
DIL14' = drill 0.813 long: 1 -7.62,-3.81; 2 -5.08,-3.81; 3 -2.54,-3.81; 4 0,-3.81; 5 2.54,-3.81; 6 5.08,-3.81; 7 7.62,-3.81; 8 7.62,3.81; 9 5.08,3.81; 10 2.54,3.81; 11 0,3.81; 12 -2.54,3.81; 13 -5.08,3.81; 14 -7.62,3.81
SO-16DW = smd 0.6 x 2.2: 1 -4.445,-4.6; 2 -3.175,-4.6; 3 -1.905,-4.6; 4 -0.635,-4.6; 5 0.635,-4.6; 6 1.905,-4.6; 7 3.175,-4.6; 8 4.445,-4.6; 9 4.445,4.6; 10 3.175,4.6; 11 1.905,4.6; 12 0.635,4.6; 13 -0.635,4.6; 14 -1.905,4.6; 15 -3.175,4.6; 16 -4.445,4.6
12 = drill 0.813 pad 1.6 octagon: 1 -6,0; 2 6,0
15 = drill 0.813 pad 1.6 octagon: 1 -7.5,0; 2 7.5,0
07 = drill 0.813 pad 1.6 octagon: 1 -3.5,0; 2 3.5,0
05 = drill 0.813 pad 1.6 octagon: 1 -2.54,0; 2 2.54,0
AK300/2 = drill 1.321 long: 1 -2.515,0; 2 2.489,0
2X04 = drill 1.016 octagon: 1 -3.81,-1.27; 2 -3.81,1.27; 3 -1.27,-1.27; 4 -1.27,1.27; 5 1.27,-1.27; 6 1.27,1.27; 7 3.81,-1.27; 8 3.81,1.27
1X07 = drill 1.016 long: 1 -7.62,0; 2 -5.08,0; 3 -2.54,0; 4 0,0; 5 2.54,0; 6 5.08,0; 7 7.62,0
CONECTOR_BTHC-06 = drill 1 pad 1.676 long: 1 -3.81,0; 2 -1.27,0; 3 1.27,0; 4 3.81,0
CONECTOR_X2_5.08 = drill 1.6 pad 2.184 long: 1 -2.54,0; 2 2.54,0
LED3MM = drill 0.813 octagon: A -1.27,0; K 1.27,0
TO220 = drill 1.016 long: B -2.54,0; C 0,0; E 2.54,0
0204/5 = drill 0.813 pad 1.676 octagon: 1 -2.54,0; 2 2.54,0
0617V = drill 1.016 pad 2.184 octagon: 1 -2.54,0; 2 2.54,0
RESISTENCIA_0805 = smd 1.3 x 1.6: 1 -0.95,0; 2 0.95,0
0204V = drill 0.813 pad 1.676 octagon: 1 -1.27,0; 2 1.27,0
TO220V = drill 1.016 long: 1 -2.54,-2.54; 2 0,-2.54; 3 2.54,-2.54
TS210 = drill 0.813 offset: 1 -2.54,-3.81; 2 0,-3.81; 4 2.54,3.81; 6 -2.54,3.81; NC1 2.54,-3.81; NC2 0,3.81
BUZZER = drill 0.914 pad 2.159 octagon: + 3.8,0; - -3.8,0
TEENSY_3.0-3.2_DIL = drill 0.965: 0 -7.62,13.97; 1 -7.62,11.43; 2 -7.62,8.89; 3 -7.62,6.35; 3.3V 7.62,11.43; 4 -7.62,3.81; 5 -7.62,1.27; 6 -7.62,-1.27; 7 -7.62,-3.81; 8 -7.62,-6.35; 9 -7.62,-8.89; 10 -7.62,-11.43; 11 -7.62,-13.97; 12 -7.62,-16.51; 13 7.62,-16.51; 14/A0 7.62,-13.97; 15/A1 7.62,-11.43; 16/A2 7.62,-8.89; 17/A3 7.62,-6.35; 18/A4 7.62,-3.81; 19/A5 7.62,-1.27; 20/A6 7.62,1.27; 21/A7 7.62,3.81; 22/A8 7.62,6.35; 23/A9 7.62,8.89; AGND 7.62,13.97; GND -7.62,16.51; VIN 7.62,16.51
TRIMPOT-PTH-3386U = drill 0.9 pad 1.88 square: 1 -2.54,-0.015 | drill 0.9 pad 1.88: 2 0,-0.015; 3 2.54,-0.015
PN61729 = drill 0.95 octagon: 1 1.25,4.71; 2 -1.25,4.71; 3 -1.25,2.71; 4 1.25,2.71 | hole 2.3: -6.02,0; 6.02,0
AK300/3 = drill 1.321 long: 1 -5.004,0; 2 0,0; 3 5.004,0

### Placement (x,y rotation side)
2N3904  48.01,118.36 0 top
5G_D  105.62,106.43 90 top
AC  33.02,153.67 90 top
AC1  134.75,40.18 0 top
C2  115.7,81.91 0 bottom
C3  57.4,130.94 180 bottom
C4  68.38,130.94 180 bottom
C19  20.83,85.34 270 top
C20  37.47,85.47 90 bottom
C21  16.89,76.96 0 top
C22  42.77,77.85 90 top
C23  20.12,64.01 0 top
C24  38.23,64.01 180 top
C31  66.8,85.34 270 top
C32  83.44,85.47 90 bottom
C33  91.95,75.82 180 top
C34  55.45,75.18 180 top
C35  84.38,64.14 180 top
C36  65.28,64.01 180 top
C64  115.57,138.29 0 top
C66  120.33,136.59 90 top
C68  124.46,142.94 270 top
C70  115.89,102.62 180 top
C71  109.85,102.62 0 top
C72  128.91,99.76 270 top
CHANNELS  79.63,106.36 0 top
D1  139.34,71.65 90 bottom
D2  58.55,111.12 90 bottom
D3  138.89,18.87 180 bottom
D31  127.95,150.24 180 bottom
D33  98.98,147.12 90 bottom
D34  117.16,144.21 0 bottom
D37  131.62,108.97 180 bottom
D38  118.36,90.04 270 bottom
D39  119.7,108.97 0 bottom
DAC  75.82,117.79 0 top
GND_HV  144.65,79.63 90 top
GPIO1  107.95,37.64 90 top
GPIO2  28.19,123.82 180 top
GPIO3  46.61,151.13 0 top
GS_1_DAC  20.83,93.34 270 top
GS_AMP1  16.89,81.91 180 top
GS_CH9  62.87,81.91 180 top
GS_CH10  66.8,93.34 270 top
IC1  28.83,84.46 270 top
IC2  74.8,84.46 270 top
IC3  74AC14N  [DIL14']  107.06,74.3 270 top
IC4  62.93,138.68 90 bottom
INT2  24.07,151.13 0 top
INTEXT  144.4,50.39 180 top
INTEXT2  132.11,51.66 270 top
J1  85.47,127.63 0 top
J2  69.98,114.05 0 top
J3  74.96,10.13 90 top
J4  5.84,85.72 0 top
J5  51.18,96.77 90 top
J6  55.12,9.91 90 top
J+15_D3  139.38,101.08 270 top
JHV+  141.22,14.1 270 top
JP1  93.01,28.46 180 top
JP2  46.36,28.44 180 top
JP4  22.61,107.7 90 top
JP6  136.8,77.88 180 top
JP9  93.66,139.19 270 top
K2  9.33,123.76 270 top
K_CH3  45,16.38 180 top
K_CH4  91.88,16.36 180 top
LED3  58.61,118.75 270 top
Q17  39.12,69.85 0 top
Q18  19.05,69.85 0 top
Q19  39.12,48.77 0 top
Q20  39.12,57.66 0 top
Q21  39.24,40.39 180 top
Q22  19.05,57.66 180 top
Q23  19.05,40.39 180 top
Q24  19.05,48.77 180 top
Q33  64.64,69.85 180 top
Q34  84.2,69.85 180 top
Q35  64.64,48.77 180 top
Q36  64.64,57.66 180 top
Q37  64.26,40.94 180 top
Q38  84.2,57.66 0 top
Q39  84.2,40.39 0 top
Q40  84.2,48.77 0 top
R1  91.74,24.05 180 bottom
R2  22.8,15.86 0 top
R3  11.81,31.31 180 bottom
R4  28.98,31.31 180 bottom
R5  45.09,24.05 180 bottom
R6  134.87,86.77 180 bottom
R7  124.59,16.26 270 bottom
R10  72.45,141.88 180 bottom
R11  38.29,113.16 90 bottom
R12  68.64,16.55 180 top
R13  33.85,116.17 90 bottom
R14  59.82,31.31 0 bottom
R15  16.38,117.35 270 bottom
R16  18.92,123.95 90 bottom
R17  78.3,31.31 0 bottom
R22  58.42,124.65 90 bottom
R23  43.18,126.94 270 bottom
R24  43.18,122.49 90 bottom
R41  11.23,90.5 270 bottom
R42  37.47,89.92 90 bottom
R45  47.62,57.66 0 top
R46  48.9,50.04 90 top
R47  10.54,57.66 0 top
R48  9.27,50.04 270 top
R57  57.2,90.5 270 bottom
R58  83.44,89.92 90 bottom
R61  56.13,57.66 180 top
R62  56.13,48.77 180 top
R63  92.2,57.66 180 top
R64  93.47,50.04 270 top
RG1  104.77,147.07 90 top
RG2  117.16,147.7 180 top
RG3  111.12,93.09 180 top
RG4  125.09,98.49 270 top
RL1  135.51,86.77 180 top
RL2  132.33,12.83 270 top
RL5  16.51,24.77 270 top
RL6  33.72,24.64 270 top
RL7  62.67,24.64 270 top
RL8  81.09,24.64 270 top
SG2  49.53,108.52 0 top
UC1  34.29,138.94 90 top
UC2  119.76,38.91 0 top
VR1  29.21,67.44 90 top
VR2  47.85,67.44 270 top
VR3  55.42,67.44 270 top
VR4  75.69,67.44 90 top
VR5  15.62,92.1 270 top
VR6  45.21,88.26 270 top
VR9  61.59,92.1 270 top
VR10  91.19,88.26 270 top
X1  139.38,26.77 90 top
X2  11.81,107.7 270 top
X3  139.38,62.36 90 top
X4  139.38,136.73 270 top

### Tracks (layer width: path | path; a pad name or v marks a point on that pad's centre or on a via)
1HV+
  Bottom 0.813: X1.1 141.59,22.05 D3.A
1HV-
  Bottom 0.813: X3.2 139.38,68.91 D1.C
3.3V  (1 unrouted)
!SYNC
  Bottom 0.508: IC4.4 46.86,138.05 45.66,136.84 45.72,136.78 UC1.10
!SYNC_ISO
  Bottom 0.508: IC4.13 85.09,138.05 87.25,135.89 87.25,122.87 85.66,121.28 80.58,121.28 79.63,122.24 DAC.CS
+5_D  (1 unrouted)
  Top 0.61: IC3.14 125.68,81.91 127.38,80.21 UC2.VIN
  Bottom 0.508: C2.2 IC3.14
  Bottom 0.61: SG2.+ 58.45,108.52 D2.C 61.05,108.43 62.48,109.85 J2.1 | 30.42,154.62 59.94,154.62 62.17,152.4 62.17,135.25 61.15,134.24 IC4.1 58.35,134.21 C3.2 58.35,125.67 R22.2 60.71,125.6 62.48,123.82 J2.1 | 30.42,154.62 19.3,154.62 17.78,153.1 UC1.VIN 17.78,143.57 9.34,135.13 K2.1 5.68,127.57 3.56,125.45 3.56,113.41 13.08,103.89 16.52,103.89 | AC.VIN 30.42,151.19 30.42,154.62 | D38.A 110.74,87.34 | IC3.14 110.87,87.22 110.74,87.34 | 110.74,87.34 108.58,89.5 RG3.3 C71.1 5G_D.1 5G_D.2 95.38,105.16 86.49,114.05 J2.2 | J2.1 | UC2.VIN 125.48,55.42 124.59,54.53 124.59,43.74 125.6,42.72 UC2.21/A7 AC1.VIN | JP4.1 JP4.2 16.52,103.89 | 16.52,103.89 X2.1
+5_HV
  Top 0.61: C66.1 113.66,135.32 111.12,137.86 111.12,148.65 110.17,149.61 RG1.3
  Bottom 0.61: DAC.VCC2 74.55,118.75 72.01,116.21 | 72.01,116.21 DAC.VCC1 | 72.01,116.21 66.61,116.21 64.71,118.11 64.71,126.37 67.43,129.09 C4.1 67.53,131.04 IC4.16 64.77,134.24 63.75,135.25 63.75,143.51 65.02,144.78 72.33,144.78 73.4,143.7 R10.2 73.62,141.67 89.85,141.67 | RG1.3 99.6,149.61 D33.A 91.92,149.77 89.85,147.7 89.85,141.67 | JP9.3 93.6,141.67 89.85,141.67
+8_D
  Bottom 0.508: D38.C 118.36,95.63
  Bottom 0.61: D39.A 116.9,109.51 C70.+ 116.9,95.69 116.84,95.63 | RG4.3 122.24,95.63 118.36,95.63 116.84,95.63 | 116.84,95.63 RG3.1
+8_HV
  Bottom 0.61: RG2.3 114.62,144.37 114.55,144.31 | 114.55,144.31 D34.A 107.63,144.21 RG1.1 99.65,144.47 D33.C 100.24,144.27 JP9.2 | C64.+ 114.55,144.31
+15_HV  (via drill 1 pad 2)  (2 unrouted)
  Top 0.508: C19.2 24.96,84.39 IC1.4 | C31.2 70.93,84.39 IC2.4
  Top 0.61: 93.66,154.05 JP9.1 | 93.66,154.05 137.92,154.05 139.38,152.59 139.38,150.33 v139.34,150.29 139.34,141.77 X4.1 | 93.66,154.05 9.4,154.05 3.3,147.96 3.3,104.65 | 3.3,104.65 J4.1 | J5.2 50.24,101.22 15.87,101.22 12.45,104.65 3.3,104.65
  Bottom 0.508: IC2.4 66.67,84.46 65.66,85.47 53.85,85.47 51.05,88.26 51.05,93.15 J5.1 | IC1.4 20.57,84.46 19.3,85.72 J4.2
  Bottom 0.61: D31.A 139.29,150.24 v139.34,150.29
-15_HV  (via drill 1 pad 2)
  Top 0.508: v67.69,74.17 63.88,77.98 49.91,77.98 48.26,79.63 48.26,92.33 46.99,93.6 42.42,93.6 41.02,92.2 41.02,86.23 39.24,84.46 IC1.11
  Top 0.61: IC2.11 85.47,84.46 88.14,81.79 94.36,81.79 96.52,83.95 96.52,131.57 | 96.52,131.57 JP9.7 | X4.3 139.23,131.57 96.52,131.57
  Bottom 0.508: IC1.11 37.4,84.46 C20.1 | C32.1 83.37,84.46 IC2.11 75.44,84.46 73.79,82.8 73.79,75.82 72.14,74.17 v67.69,74.17
C_15D
  Bottom 0.61: GPIO1.11 UC2.2
C_CH1
  Bottom 0.508: 33.78,104.27 59.94,104.27 63.12,101.09 99.31,101.09 101.98,98.43 101.98,83.19 IC3.1 | 33.78,104.27 33.84,104.33 R13.1 | 33.78,104.27 28.45,104.27 23.37,99.19 11.94,99.19 5.33,92.58 5.33,37.85 7.87,35.31 26.49,35.31 28.03,33.77 R4.1
C_CH1N  (via drill 1 pad 2)
  Top 0.508: v29.26,99.26 13.08,99.31 6.35,92.58 6.35,82.8 arc90 6.86,82.3 7.11,82.3 arc-90 8.13,81.28 8.13,81.03 arc-90 7.24,80.14 5.33,80.14 arc90 4.32,79.12 4.32,78.87 arc90 5.21,77.98 7.11,77.98 arc-90 8.13,76.96 8.13,76.71 arc-90 7.11,75.69 5.71,75.69 arc90 4.45,74.42 arc90 5.59,73.28 6.73,73.28 arc-90 8,72.01 8,71.75 arc-90 6.98,70.74 5.84,70.74 arc90 4.57,69.47 arc90 5.84,68.2 7.24,68.2 arc-90 8.13,67.31 8.13,67.18 arc-90 7.11,66.17 5.84,66.17 arc90 4.95,64.9 arc90 6.48,64.01 6.98,64.01 arc-90 8.38,63.12 8.38,62.74 arc-90 6.98,61.85 arc90 6.35,61.09 v6.35,32.89
  Bottom 0.508: IC3.2 100.96,79.38 98.81,81.53 98.81,96.77 96.39,99.19 61.98,99.19 58.55,102.62 32.61,102.62 v29.26,99.26 | v6.35,32.89 7.94,31.3 R3.1
C_CH2  (via drill 1 pad 2)
  Top 0.508: IC3.3 99.06,76.83 97.92,75.69 97.92,60.93 97.31,60.33 v97.16,60.33
  Bottom 0.508: R11.1 38.29,107.76 40.26,105.79 61.21,105.79 64.01,103 101.22,103 104.39,99.82 104.39,87.12 106.68,84.84 106.68,77.6 105.92,76.83 IC3.3 | R17.1 90.36,31.3 91.44,32.39 91.44,34.54 93.09,36.19 95.12,36.19 97.16,38.23 v97.16,60.33
C_CH2N  (via drill 1 pad 2)  (1 unrouted)
  Top 0.508: v101.79,11.24 101.79,8.7 99.75,6.66 J3.1
  Bottom 0.508: IC3.4 100.58,74.3 99.44,73.15 99.44,65.66 101.79,63.31 v101.79,11.24 | R14.1 70.3,31.3 73.46,28.14 73.46,20.73 74.95,19.23 J3.2
C_HV+  (via drill 1)
  Top 0.61: v118.74,28.88 120.14,27.48 UC2.15/A1
  Bottom 0.61: v118.74,28.88 118.74,68.33 124.71,74.3 124.71,80.95 130.58,86.82 R6.1
C_HV-
  Bottom 0.813: UC2.14/A0 125.98,24.94 124.59,23.55 R7.1
CH1
  Top 0.61: IC1.3 27.3,87 27.81,87.5 27.81,93.85 32.13,98.17 72.39,98.17 77.09,102.87 CHANNELS.2
  Bottom 0.61: DAC.CH1 CHANNELS.2
CH2
  Top 0.61: IC2.3 73.28,87 73.79,87.5 73.79,95.58 79.63,101.42 CHANNELS.3
  Bottom 0.61: DAC.CH2 CHANNELS.3
CH3
  Bottom 0.61: DAC.CH3 CHANNELS.4
CH4
  Bottom 0.61: DAC.CH4 CHANNELS.5
D+
  Bottom 0.508: X2.3 14.52,109.77 15.62,110.87 18.16,110.87 20.07,108.97 JP4.6 JP4.5
D-
  Bottom 0.508: X2.2 17.55,108.95 20.07,106.43 JP4.4 JP4.3
DIN
  Bottom 0.508: IC4.3 49.72,136.78 48.26,135.32 UC1.11
DIN_ISO
  Bottom 0.508: IC4.14 80.01,136.78 82.17,134.62 DAC.MOSI
GND_D  (via drill 1 pad 2)  (1 unrouted)
  Top 0.61: GPIO3.5 53.28,151.13 54.23,150.18 54.23,141.92 | J1.1 79.47,138.59 76.14,141.92 54.23,141.92 | v33.02,141.99 33.08,141.92 54.23,141.92 | UC2.AGND 117.35,52.88 114.81,55.42 UC2.GND | v40.51,121.54 39.12,121.54 36.83,123.82 GPIO2.1
  Top 0.813: RG4.2 116.2,98.49 114.87,99.82 C70.-
  Bottom 0.508: RL8.2 79.48,24.64 81.3,22.81 81.3,9.27 | 14.5,106.43 X2.4 | 21.34,112.14 JP4.8 | 16.38,112.8 16.41,112.78
  Bottom 0.61: AC.GND UC1.20/A6 v33.02,141.99 31.75,140.72 20.32,140.72 | 20.32,140.72 UC1.AGND 20.32,149.92 21.53,151.13 INT2.1 | 20.32,140.72 17.78,138.18 UC1.GND 11.49,125.03 K2.2 6.86,125.03 5.65,123.82 5.65,117.47 6.73,116.4 R15.2 | GPIO2.1 33.27,121.28 28.39,116.4 R15.2 | C72.2 128.91,93.85 128.92,94.3 | RL5.2 9.78,24.77 7.62,22.61 7.62,11.94 10.29,9.27 33.15,9.27 | 33.15,9.27 61.37,9.27 | 61.37,9.27 74.3,9.27 | 74.3,9.27 81.3,9.27 103.25,9.27 104.27,10.29 104.27,63.88 | RL6.2 31.88,24.64 33.15,23.37 33.15,9.27 | 74.17,9.4 74.3,9.27 | C2.1 116.65,81.79 | 135.51,94.3 128.92,94.3 | RL7.2 60.2,24.64 61.34,23.5 61.34,9.3 61.37,9.27 | 5G_D.4 5G_D.3 | 112.27,63.88 113.03,63.88 114.76,65.61 114.76,76.99 116.65,78.88 116.65,81.79 | 112.27,63.88 104.27,63.88 | 135.13,40.18 AC1.GND | 135.13,40.18 136.53,41.58 136.53,51.36 134.95,52.93 INTEXT2.1 132.06,52.88 UC2.AGND | IC3.7 103.25,64.9 104.27,63.88 | UC2.GND 112.14,63.75 112.27,63.88 | 2N3904.E 43.18,119.38 R24.1 v40.51,121.54 | 135.13,40.18 135.13,33.2 131.83,29.9 131.83,14.1 130.56,12.83 RL2.2 | 128.92,94.3 128.92,89.04 121.67,81.79 116.65,81.79 | RL1.2 135.51,94.3 | 135.51,94.3 137.96,94.3 139.38,95.72 J+15_D3.2 | 14.5,106.43 13.72,106.43 12.45,107.7 12.45,110.11 15.11,112.78 16.41,112.78 20.7,112.78 21.34,112.14 | JP4.8 JP4.7 | R15.2 16.38,112.8
  Bottom 0.813: C71.2 RG3.2 | C71.2 C70.- | RG4.2 C72.2 | J1.2 91.47,114.27 95.5,110.24 5G_D.4 | C71.2 111.12,105.92 109.35,107.7 5G_D.3
GND_HV  (via drill 0.35 pad 2, 1 pad 2)
  Top 0.813: DAC.GND1 66.93,114.62 72.01,119.7 | 72.01,119.7 DAC.GND2 | 72.01,119.7 83.76,119.7 84.71,120.65 DAC.GND3 84.71,136.65 87.25,139.19 JP9.4 | GS_1_DAC.2 C19.1 20.76,86.36 16.51,86.36 15.62,85.47 GS_AMP1.2 | GS_CH10.2 C31.1 66.74,86.36 62.48,86.36 61.59,85.47 GS_CH9.2 | RG2.2 117.16,138.87 C64.- | RG1.2 104.77,147.07 102.55,144.84 102.55,140.65 101.09,139.19 JP9.4 | 52.2,10.67 42.32,10.67 | 42.32,10.67 34.67,10.67 29.48,15.86 R2.2 | 52.23,10.71 52.2,10.67 | v86.49,78.36 85.6,78.36 80.64,73.41 74.6,73.41 72.08,70.89 72.08,66.32 C36.1 | 89.31,10.67 66.04,10.67 | 66.04,10.67 52.2,10.67 | JP9.4 JP9.5 JP9.6 | 52.2,10.67 52.2,32.35 v52.23,32.39 | 99.95,14.61 103.5,14.61 113.03,5.08 140.59,5.08 145.29,9.78 145.29,26.85 142.88,29.26 X1.2 | 99.95,14.61 99.95,32 v99.88,32.07 | R12.2 66.1,10.73 66.04,10.67 | K_CH3.2 42.46,10.81 42.32,10.67 | K_CH4.2 89.34,10.71 89.31,10.67 | 99.95,14.61 96.01,10.67 89.31,10.67
  Bottom 0.508: IC4.9 66.23,143.13 65.34,142.24 65.34,136.21 66.04,135.51 IC4.15 70.48,135.51 72.01,133.98 72.01,130.81 | 72.01,130.81 DAC.GND2 | 69.46,130.81 72.01,130.81
  Bottom 0.813: C4.2 69.46,130.81 | DAC.GND1 66.93,107.63 68.2,106.36 CHANNELS.1 | R42.1 C20.2 40.4,86.42 42.75,84.07 42.75,80.49 C22.2 | GS_AMP1.2 C21.1 12.45,73.79 12.45,66.17 14.61,64.01 C23.1 19.1,64.06 21.67,66.62 25.7,66.62 27.43,64.9 VR1.1 30.28,64.9 33.02,67.64 33.02,72.67 34.14,73.79 36.07,73.79 37.47,75.18 37.47,77.72 38.86,79.12 C22.2 | R58.1 C32.2 85.16,86.42 85.98,85.47 86.49,84.96 v86.49,78.36 92.46,78.36 93.22,77.6 C33.1 93.27,75.77 93.27,64.06 | C64.- 119.9,138.29 | 119.9,138.29 C66.2 | RG1.2 109.85,147.07 111.12,148.34 111.12,152.15 112.71,153.73 115.89,153.73 117.16,152.46 RG2.2 | 99.95,32.13 v99.88,32.07 99.88,62.04 97.87,64.06 93.27,64.06 | v52.23,32.39 52.23,33.74 52.2,33.78 52.25,64.03 52.25,64.64 | 144.65,126.49 144.62,126.45 144.59,126.48 | X1.2 X3.1 142.98,59.84 144.65,61.52 GND_HV.1 GND_HV.2 GND_HV.3 GND_HV.4 144.65,126.49 | C35.1 88.95,64.06 93.27,64.06 | C68.2 124.46,138.33 | 124.46,138.33 123.05,138.29 119.9,138.29 | GS_CH9.2 58.83,81.91 56.03,79.12 54.1,79.12 | C22.2 54.1,79.12 | 54.1,79.12 54.18,79.04 C34.2 54.18,74.17 52.25,72.24 52.25,64.64 | C36.1 74.97,64.01 VR4.1 | 52.25,64.64 52.4,64.8 55.31,64.8 VR3.3 | C24.1 43.62,64.9 VR2.3 47.94,64.8 52.09,64.8 52.25,64.64 | 124.46,138.33 126.06,136.73 X4.2 142.8,136.73 144.65,134.87 144.65,126.49
GNDI
  Bottom 0.508: IC4.2 59.88,135.51 60.58,136.21 60.58,142.24 59.69,143.13 IC4.8
  Bottom 0.61: IC4.2 55.75,135.51 54.86,134.62 54.86,132.53 C3.1
GPIO1
  Bottom 0.508: UC1.2 25.4,129.29 23.11,127 GPIO2.5
GPIO2
  Bottom 0.508: UC1.3 27.94,128.97 25.65,126.68 GPIO2.4
GPIO3
  Bottom 0.508: UC1.4 30.42,131.25 30.42,129.22 28.19,127 GPIO2.3
GPIO4
  Bottom 0.508: UC1.5 33.02,128.97 30.73,126.68 GPIO2.2
GPIO5
  Bottom 0.508: GPIO3.4 49.15,148.91 48.2,147.96 48.2,146.62 UC1.14/A0
GPIO6
  Bottom 0.508: GPIO3.3 46.61,149.22 45.66,148.27 45.66,146.62 UC1.15/A1
GPIO7
  Bottom 0.508: GPIO3.2 44.07,149.22 43.12,148.27 43.12,146.62 UC1.16/A2
GPIO8
  Bottom 0.508: GPIO3.1 41.53,149.22 40.64,148.34 UC1.17/A3
GS_CH1
  Top 0.61: IC1.14 30.48,92.07 29.84,91.31 29.84,81.91 | 29.84,81.91 IC1.10 44.07,81.91 45.2,83.04 VR6.3 | 29.84,81.91 IC1.5 GS_AMP1.1
  Bottom 0.508: VR6.2 VR6.3
GS_CH2
  Top 0.61: 75.69,81.91 IC2.5 GS_CH9.1 | 75.69,81.91 IC2.10 | 75.69,81.91 75.69,91.19 75.82,91.31 76.45,92.07 IC2.14 83.95,92.07 87.76,88.26 VR10.2
  Bottom 0.61: VR10.3 VR10.2
HV+  (via drill 1 pad 2)
  Top 0.813: v88.27,35.31 100.08,35.31 104.01,31.37 104.01,18.8 115.06,7.75 134.75,7.75 136.14,9.14 RL2.4 | R45.2 R61.2
  Bottom 0.813: C24.2 36.14,61.59 47.37,61.59 48.9,60.07 R45.2 R46.2 | 60.83,61.09 71.88,61.09 73.91,59.05 73.91,37.59 76.2,35.31 v88.27,35.31 | C36.2 60.78,62.67 60.83,61.09 | 60.83,61.09 56.52,61.09 54.86,59.44 R61.2 R62.2 | JHV+.2 141.22,11.05 140.46,10.29 RL2.4
HV-  (via drill 1 pad 2)  (1 unrouted)
  Top 0.813: v49.15,36.19 53.21,36.19 55.12,34.29 J6.2 | v121.41,61.59 105.28,61.59 101.47,57.78 93.6,57.78 R63.1
  Bottom 0.61: C35.2 79.88,63.25 81.28,61.85 91.82,61.85 93.47,60.2 R63.1 R64.1
  Bottom 0.813: R48.1 R47.1 9.27,59.18 11.53,61.44 24.55,61.44 | C23.2 24.55,61.44 | 24.55,61.44 27.59,61.44 29.72,59.31 29.72,39.62 33.15,36.19 v49.15,36.19 | J6.1 57.21,4.32 117.35,4.32 121.41,8.38 v121.41,61.59 121.41,65.15 123.9,67.64 130.63,67.64 132.97,69.98 132.97,77.88 | 132.97,77.88 RL1.4 | JP6.2 132.97,77.88
N$1
  Top 0.61: INTEXT2.2 INTEXT.2
  Bottom 0.61: UC2.23/A9 130.96,47.8 132.11,48.95 INTEXT2.2
N$2
  Bottom 0.508: RL5.1 12.7,31.25 R3.2
N$3
  Bottom 0.508: R4.2 29.91,31.3 RL6.1
N$4
  Bottom 0.813: RL5.4 20.32,15.92 R2.1
N$5  (via drill 1 pad 2)
  Top 0.61: UC1.8 40.64,134.11 38.99,135.76 15.75,135.76 12.06,139.45 v12.06,151.26 | v12.06,156.34 12.83,157.1 138.91,157.1 148.08,147.93 148.08,52.86 145.67,50.44 INTEXT.1
  Bottom 0.61: v12.06,151.26 v12.06,156.34
N$6
  Bottom 0.61: GPIO1.13 UC2.0
N$7
  Bottom 0.61: UC2.1 GPIO1.12
N$8
  Bottom 0.61: RL6.4 40.26,22.1 42.22,24.05 R5.1 42.55,25.89 JP2.2
N$9
  Bottom 0.61: D37.A 137.8,108.97 139.38,107.38 J+15_D3.1
N$10
  Bottom 0.61: GPIO1.10 UC2.3
N$11
  Bottom 0.61: UC2.4 GPIO1.9
N$12
  Bottom 0.61: UC2.5 GPIO1.8
N$13
  Bottom 0.508: RL7.1 R14.2
N$14
  Bottom 0.61: GPIO1.7 UC2.6
N$15
  Bottom 0.61: UC2.7 GPIO1.6
N$16
  Bottom 0.508: RL8.1 77.28,31.24 R17.2
N$17
  Bottom 0.813: RL7.4 69.49,22.1 71.2,20.4 71.2,16.56 R12.1
N$18
  Bottom 0.61: JP2.1 R5.2 47.54,23.97 K_CH3.1
N$19
  Bottom 0.61: GPIO1.5 UC2.8
N$20
  Bottom 0.61: UC2.9 GPIO1.4
N$21
  Bottom 0.61: GPIO1.3 UC2.10
N$22
  Bottom 0.61: UC2.11 GPIO1.2
N$23
  Bottom 0.61: GPIO1.1 UC2.12
N$24
  Bottom 0.61: RL1.1 138.05,87.53 137.29,86.77 R6.2
N$25
  Bottom 0.61: JP1.1 R1.2 94.42,23.91 K_CH4.1
N$26
  Bottom 0.61: RL8.4 87.3,22.1 R1.1 89.2,27.05 90.51,28.36 JP1.2
N$27
  Bottom 0.813: RL2.1 124.65,15.37 R7.2
N$29
  Bottom 0.61: RL1.6 138.05,77.9 JP6.1
  Bottom 0.813: JP6.1 139.34,76.61 D1.A
N$30
  Bottom 0.813: D3.C 136.14,18.83 RL2.6 JHV+.1
N$66
  Bottom 0.508: IC4.10 71.48,141.86 R10.1
N$67
  Bottom 0.508: R13.2 35.56,118.83 UC1.6
N$68
  Bottom 0.508: UC1.7 38.1,114.3 R11.2
N$69
  Bottom 0.508: R16.1 18.92,119 18.16,118.24 R15.1 11.05,118.24 K2.4
N$70
  Bottom 0.508: UC1.1 22.86,129.92 18.92,125.98 R16.2
N$71
  Bottom 0.508: UC1.0 20.32,130.87 14.54,125.09 14.54,123.82 13.21,122.49 K2.3
N$72
  Bottom 0.508: LED3.A 58.61,123.51 R22.1
N$73
  Bottom 0.508: SG2.- 45.66,108.59 45.66,111.6 47.88,113.82 50.67,113.82 | LED3.K 58.61,113.89 D2.A 50.67,113.82 | 2N3904.C 50.55,113.95 50.67,113.82
N$74
  Bottom 0.508: R23.2 R24.2 46.61,123.44 48.01,122.05 2N3904.B
N$75
  Bottom 0.508: UC1.23/A9 25.34,146.62 INT2.2
N$106
  Bottom 0.61: IC1.2 15.63,89.53 VR5.3 11.24,89.56 R41.2
N$107
  Bottom 0.61: IC1.12 29.59,87 28.7,87.88 28.7,91.06 27.69,92.07 IC1.1 25.02,93.73 24.13,94.62 GS_1_DAC.1 20.8,94.64 VR5.1 VR5.2
N$108
  Bottom 0.61: IC1.13 34.42,89.53 35.75,90.87 R42.2 42.59,90.87 VR6.1
N$109
  Top 0.61: Q17.E 41.78,69.98 41.78,72.39 34.8,79.38 IC1.9
  Bottom 0.61: VR2.2 VR2.1 41.78,69.98 Q17.E
N$110
  Bottom 0.61: IC1.6 22.48,79.38 21.59,78.49 Q18.E 29.15,69.85 29.23,69.93 | VR1.2 29.23,69.93 | 29.23,69.93 VR1.3
N$111
  Top 0.61: Q18.C Q22.C 19.05,53.97 20.45,52.58 23.49,52.58 24.64,51.44 24.64,41.28 23.75,40.39 Q23.B
  Bottom 0.61: C21.2 18.16,74.8 19.05,73.91 Q18.C 19.05,69.34
N$112
  Top 0.61: Q17.C Q20.C 39.12,54.48 38.1,53.47 34.8,53.47 33.78,52.45 33.78,44.83 34.8,43.81 40.89,43.81 41.78,42.93 Q21.B
  Bottom 0.61: Q17.C 39.12,73.79 39.98,74.65 41.86,74.65 42.77,75.56 C22.1
N$113
  Bottom 0.61: R45.1 Q20.E
N$114
  Bottom 0.813: R46.1 Q19.E
N$115
  Bottom 0.813: Q20.B Q19.B | Q19.C Q19.B | Q19.B 36.58,40.51 Q21.E
N$116
  Bottom 0.813: Q22.B Q24.B Q24.C 19.05,45.59 16.51,43.05 Q23.E
N$117
  Bottom 0.61: R47.2 Q22.E
N$118
  Bottom 0.813: R48.2 Q24.E
N$119
  Top 0.61: Q17.B 36.58,72.39 32.64,76.33 IC1.8
N$120
  Top 0.61: IC1.7 25.02,74.3 24.13,73.41 17.65,73.41 16.51,72.26 Q18.B
N$136
  Bottom 0.61: IC2.2 61.61,89.53 VR9.3 57.21,89.56 R57.2
N$137
  Bottom 0.61: IC2.12 75.56,87 74.68,87.88 74.68,91.06 73.66,92.07 IC2.1 70.99,93.73 70.1,94.62 GS_CH10.1 66.78,94.64 VR9.1 VR9.2
N$138
  Bottom 0.61: IC2.13 80.39,89.53 81.72,90.87 R58.2 88.56,90.87 VR10.1
N$139
  Bottom 0.61: IC2.6 67.44,79.38 62.1,74.04 Q33.E 55.43,69.85 VR3.1 VR3.2
N$140
  Bottom 0.61: IC2.9 76.58,79.38 75.69,78.49 75.69,69.84 VR4.3 | VR4.3 VR4.2 | VR4.3 81.53,69.98 Q34.E
N$141
  Top 0.61: Q39.B 78.99,40.39 78.23,41.15 78.23,52.7 79.25,53.72 83.06,53.72 84.2,54.86 Q38.C Q34.C 84.2,72.39 85.85,74.04 88.9,74.04 C33.2
N$142
  Top 0.61: Q36.C Q33.C 64.64,74.04 63.5,75.18 C34.1
  Bottom 0.61: Q36.C 64.64,54.23 65.91,52.96 69.72,52.96 70.99,51.69 70.99,42.42 69.52,40.94 Q37.B
N$143
  Bottom 0.61: R61.1 Q36.E
N$144
  Bottom 0.813: R62.1 Q35.E
N$145
  Top 0.813: Q36.B Q35.B 67.18,48.13
  Bottom 0.813: Q37.E 61.72,43.31 64.64,46.23 Q35.C Q35.B
N$146
  Bottom 0.813: Q39.E 86.74,42.8 84.2,45.34 Q40.C Q40.B Q38.B
N$147
  Bottom 0.813: Q38.E R63.2
N$148
  Bottom 0.813: Q40.E R64.2
N$149
  Top 0.508: 67.31,69.98 Q33.B
  Top 0.61: IC2.7 70.99,73.66 67.31,69.98
N$150
  Bottom 0.61: Q34.B 86.74,72.01 85.34,73.41 79.38,73.41 78.61,74.17 IC2.8
N$157
  Bottom 0.61: D31.C RG2.1 119.86,150.08 D34.C C68.1
N$158
  Bottom 0.61: D39.C 122.55,109.44 RG4.1 C72.1 | 129.54,101.03 C72.1 | D37.C 128.91,105.63 C72.1
S_BZ
  Bottom 0.508: R23.1 UC1.9
S_CH1
  Top 0.813: Q23.C 19.05,37.59 20.32,36.32 | 20.32,36.32 38.1,36.32 | 38.1,36.32 39.24,37.47 Q21.C | 20.32,36.32 RL5.6 | RL6.6 38.1,27.75 38.1,36.32
S_CH2
  Top 0.813: RL7.6 66.48,36.26 | 66.48,36.26 64.26,38.48 Q37.C | Q39.C 84.2,36.45 | 84.2,36.45 84.9,35.75 RL8.6 | 84.2,36.45 66.67,36.45 66.48,36.26
SCL
  Bottom 0.508: AC.SCL UC1.19/A5
SCL2
  Bottom 0.61: UC2.19/A5 AC1.SCL
SCLK
  Bottom 0.508: IC4.5 51.75,139.32 50.74,140.34 50.74,146.49 UC1.13
SCLK_ISO
  Bottom 0.508: IC4.12 86.99,139.32 89.15,137.16 89.15,122.24 86.61,119.7 78.04,119.7 77.09,120.65 DAC.SCLK
SDA
  Bottom 0.508: UC1.18/A4 AC.SDA
SDA2
  Bottom 0.61: UC2.18/A4 AC1.SDA
VREF  (via drill 1 pad 2)
  Top 0.61: DAC.VREFD 66.93,119.51 64.39,116.97 64.39,107.7 v57.28,100.58
  Bottom 0.61: R41.1 11.3,91.53 11.3,94.49 13.72,96.9 27.3,96.9 28.58,95.63 57.28,95.63 | R57.1 57.28,91.53 57.28,95.63 | v57.28,100.58 57.28,95.63

### Text on the board
tPlace: ◄ V1.0 Rev20 ► / Maio 2018 | 2 CHANNELS | STIMULATOR
bNames: +15 | +15 | +15 | +15 | GND | -15 | GND_HV | +5 | -15 | G | G | GND | G | +15_D | G | + D- D+ - | +5 | S | S | GND_D | G | G | G | S | G | S | HV- | GND | G | +5 | GND | GND | SHUNT | SHUNT | HV- | S G | S G